# Altium project Gesturelink.PrjPcb (part 3 of 4)

## Sheet eMMC Memory.SchDoc
size A4; SheetNumber: 7; SheetTotal: 16
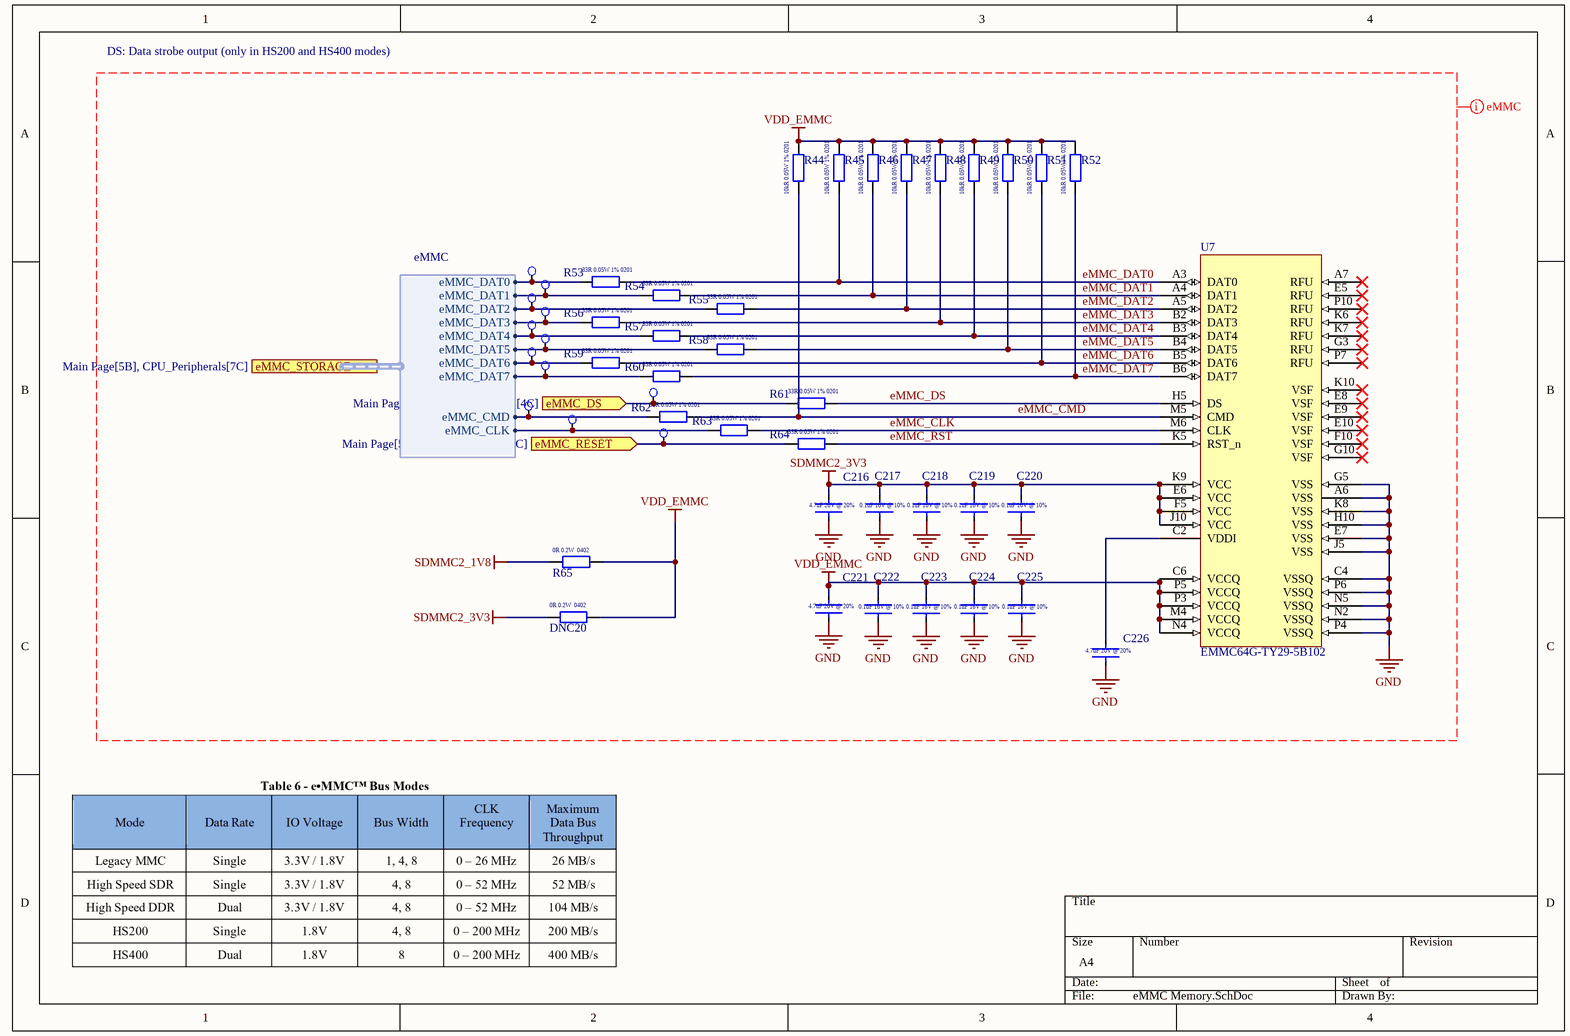
[diagram p14: eMMC Memory.SchDoc]

### Parts
C216  4.7uF  [CAPC1005X06L]  (value not drawn)
C217  0.1uF  [CAPC0603X03L]  (value not drawn)
C218  0.1uF  [CAPC0603X03L]  (value not drawn)
C219  0.1uF  [CAPC0603X03L]  (value not drawn)
C220  0.1uF  [CAPC0603X03L]  (value not drawn)
C221  4.7uF  [CAPC1005X06L]  (value not drawn)
C222  0.1uF  [CAPC0603X03L]  (value not drawn)
C223  0.1uF  [CAPC0603X03L]  (value not drawn)
C224  0.1uF  [CAPC0603X03L]  (value not drawn)
C225  0.1uF  [CAPC0603X03L]  (value not drawn)
C226  4.7uF  [CAPC1005X06L]  (value not drawn)
DNC20  CRCW04020000Z0EDHP  [RESC1005X04L]  (value not drawn)
R44  ERJ-1GNF1002C  [RESC0603X03L]  (value not drawn)
R45  ERJ-1GNF1002C  [RESC0603X03L]  (value not drawn)
R46  ERJ-1GNF1002C  [RESC0603X03L]  (value not drawn)
R47  ERJ-1GNF1002C  [RESC0603X03L]  (value not drawn)
R48  ERJ-1GNF1002C  [RESC0603X03L]  (value not drawn)
R49  ERJ-1GNF1002C  [RESC0603X03L]  (value not drawn)
R50  ERJ-1GNF1002C  [RESC0603X03L]  (value not drawn)
R51  ERJ-1GNF1002C  [RESC0603X03L]  (value not drawn)
R52  ERJ-1GNF1002C  [RESC0603X03L]  (value not drawn)
R53  ERJ-1GNF33R0C  [RESC0603X03L]  (value not drawn)
R54  ERJ-1GNF33R0C  [RESC0603X03L]  (value not drawn)
R55  ERJ-1GNF33R0C  [RESC0603X03L]  (value not drawn)
R56  ERJ-1GNF33R0C  [RESC0603X03L]  (value not drawn)
R57  ERJ-1GNF33R0C  [RESC0603X03L]  (value not drawn)
R58  ERJ-1GNF33R0C  [RESC0603X03L]  (value not drawn)
R59  ERJ-1GNF33R0C  [RESC0603X03L]  (value not drawn)
R60  ERJ-1GNF33R0C  [RESC0603X03L]  (value not drawn)
R61  ERJ-1GNF33R0C  [RESC0603X03L]  (value not drawn)
R62  ERJ-1GNF33R0C  [RESC0603X03L]  (value not drawn)
R63  ERJ-1GNF33R0C  [RESC0603X03L]  (value not drawn)
R64  ERJ-1GNF33R0C  [RESC0603X03L]  (value not drawn)
R65  CRCW04020000Z0EDHP  [RESC1005X04L]  (value not drawn)
TP7  Test Point  [Test Point]  (value not drawn)
TP8  Test Point  [Test Point]  (value not drawn)
TP9  Test Point  [Test Point]  (value not drawn)
TP10  Test Point  [Test Point]  (value not drawn)
TP11  Test Point  [Test Point]  (value not drawn)
TP12  Test Point  [Test Point]  (value not drawn)
TP13  Test Point  [Test Point]  (value not drawn)
TP14  Test Point  [Test Point]  (value not drawn)
TP15  Test Point  [Test Point]  (value not drawn)
TP16  Test Point  [Test Point]  (value not drawn)
TP17  Test Point  [Test Point]  (value not drawn)
TP18  Test Point  [Test Point]  (value not drawn)
U7  EMMC64G-TY29-5B102  [EMMC64G-TY29-5B102]

### Ports
eMMC_DS (in, see Main Page[5B], CPU_Peripherals[4C]), eMMC_RESET (in, see Main Page[5B], CPU_Peripherals[4C]), eMMC_STORAGE (harness eMMC, see Main Page[5B], CPU_Peripherals[7C])

### Harnesses
eMMC: eMMC_DAT0, eMMC_DAT1, eMMC_DAT2, eMMC_DAT3, eMMC_DAT4, eMMC_DAT5, eMMC_DAT6, eMMC_DAT7, eMMC_CMD, eMMC_CLK

### Nets
GND: C216.1 C217.1 C218.1 C219.1 C220.1 C221.1 C222.1 C223.1 C224.1 C225.1 C226.1 U7.A6(VSS) U7.C4(VSSQ) U7.E7(VSS) U7.G5(VSS) U7.H10(VSS) U7.J5(VSS) U7.K8(VSS) U7.N2(VSSQ) U7.N5(VSSQ) U7.P4(VSSQ) U7.P6(VSSQ)
SDMMC2_1V8: R65.1
SDMMC2_3V3: C216.2 C217.2 C218.2 C219.2 C220.2 DNC20.1 U7.E6(VCC) U7.F5(VCC) U7.J10(VCC) U7.K9(VCC)
VDD_EMMC: C221.2 C222.2 C223.2 C224.2 C225.2 DNC20.2 R44.2 R45.2 R46.2 R47.2 R48.2 R49.2 R50.2 R51.2 R52.2 R65.2 U7.C6(VCCQ) U7.M4(VCCQ) U7.N4(VCCQ) U7.P3(VCCQ) U7.P5(VCCQ)
eMMC_CLK: R63.2 U7.M6(CLK)
eMMC_CLK_MPU: R63.1 TP17.12 ; port eMMC_STORAGE.eMMC_CLK
eMMC_CMD: R44.1 R62.2 U7.M5(CMD)
eMMC_CMD_MPU: R62.1 TP16.12 ; port eMMC_STORAGE.eMMC_CMD
eMMC_DAT0: R45.1 R53.2 U7.A3(DAT0)
eMMC_DAT0_MPU: R53.1 TP7.12 ; port eMMC_STORAGE.eMMC_DAT0
eMMC_DAT1: R46.1 R54.2 U7.A4(DAT1)
eMMC_DAT1_MPU: R54.1 TP8.12 ; port eMMC_STORAGE.eMMC_DAT1
eMMC_DAT2: R47.1 R55.2 U7.A5(DAT2)
eMMC_DAT2_MPU: R55.1 TP9.12 ; port eMMC_STORAGE.eMMC_DAT2
eMMC_DAT3: R48.1 R56.2 U7.B2(DAT3)
eMMC_DAT3_MPU: R56.1 TP10.12 ; port eMMC_STORAGE.eMMC_DAT3
eMMC_DAT4: R49.1 R57.2 U7.B3(DAT4)
eMMC_DAT4_MPU: R57.1 TP11.12 ; port eMMC_STORAGE.eMMC_DAT4
eMMC_DAT5: R50.1 R58.2 U7.B4(DAT5)
eMMC_DAT5_MPU: R58.1 TP12.12 ; port eMMC_STORAGE.eMMC_DAT5
eMMC_DAT6: R51.1 R59.2 U7.B5(DAT6)
eMMC_DAT6_MPU: R59.1 TP13.12 ; port eMMC_STORAGE.eMMC_DAT6
eMMC_DAT7: R52.1 R60.2 U7.B6(DAT7)
eMMC_DAT7_MPU: R60.1 TP14.12 ; port eMMC_STORAGE.eMMC_DAT7
eMMC_DS: R61.2 U7.H5(DS)
eMMC_DS_MPU: R61.1 TP15.12 ; port eMMC_DS
eMMC_RST: R64.2 U7.K5(RST_n)
eMMC_RST_MPU: R64.1 TP18.12 ; port eMMC_RESET
NetC226_2: C226.2 U7.C2(VDDI)

Not connected (* = marked no-connect by the designer): U7 A7(RFU)* E5(RFU)* E8(VSF)* E9(VSF)* E10(VSF)* F10(VSF)* G3(RFU)* G10(VSF)* K6(RFU)* K7(RFU)* K10(VSF)* P7(RFU)* P10(RFU)*

### Layout directives
net class eMMC: eMMC_CLK, eMMC_CMD, eMMC_DAT0, eMMC_DAT1, eMMC_DAT2, eMMC_DAT3, eMMC_DAT4, eMMC_DAT5, eMMC_DAT6, eMMC_DAT7, eMMC_DS, eMMC_RST, GND, SDMMC2_1V8, SDMMC2_3V3, VDD_EMMC

### Notes on the sheet
- DS: Data strobe output (only in HS200 and HS400 modes)
- (in symbol CL05A475MO5NUNC) 4.7uF 20V @ 20%
- (in symbol CRCW04020000Z0EDHP) 0R 0.2W  0402
- (in symbol ERJ-1GNF33R0C) 33R 0.05W 1% 0201
- (in symbol ERJ-1GNF1002C) 10kR 0.05W 1% 0201
- (in symbol GRM033R61E104KE14J) 0.1uF 16V @ 10%

### Library data of the parts
C216 C221 C226 = CL05A475MO5NUNC: as C97 on sheet LPDDR4
C217-C220 C222-C225 = GRM033R61E104KE14J: as C98-C125 on sheet LPDDR4
DNC20 R65 = CRCW04020000Z0EDHP: 0 Ohms Jumper Chip Resistor 0402 (1005 Metric) Automotive AEC-Q200, Pulse Withstanding Thick Film; ComponentLink1Description: New link; ComponentLink1URL: https://www.digikey.com.au/en/products/detail/vishay-dale/CRCW04020000Z0EDHP/2222496
R44-R52 = ERJ-1GNF1002C: as R15 on sheet Power Management; ComponentLink1Description: New link; ComponentLink1URL: https://www.digikey.com.au/en/products/detail/panasonic-electronic-components/ERJ-1GNF1002C/2036226
R53-R64 = ERJ-1GNF33R0C: as R16-R20 on sheet Power Management; ComponentLink1Description: New link; ComponentLink1URL: https://www.digikey.com.au/en/products/detail/panasonic-electronic-components/ERJ-1GNF33R0C/2035941
U7 = EMMC64G-TY29-5B102: eMMC pSLC eMMC 5.1 (HS400) 153B 64GB; ComponentLink1Description: New link; ComponentLink1URL: https://www.digikey.com.au/en/products/detail/kingston-technology/EMMC64G-TY29-5B102/23544210?srsltid=AfmBOoplT4W8nAr74tqJNFMNLtQIICeKqThZaKy8fUOfiCqFJlsEGKlk

## Sheet WIFI and BLE.SchDoc
size 420 x 297 mm; SheetNumber: 8; SheetTotal: 16
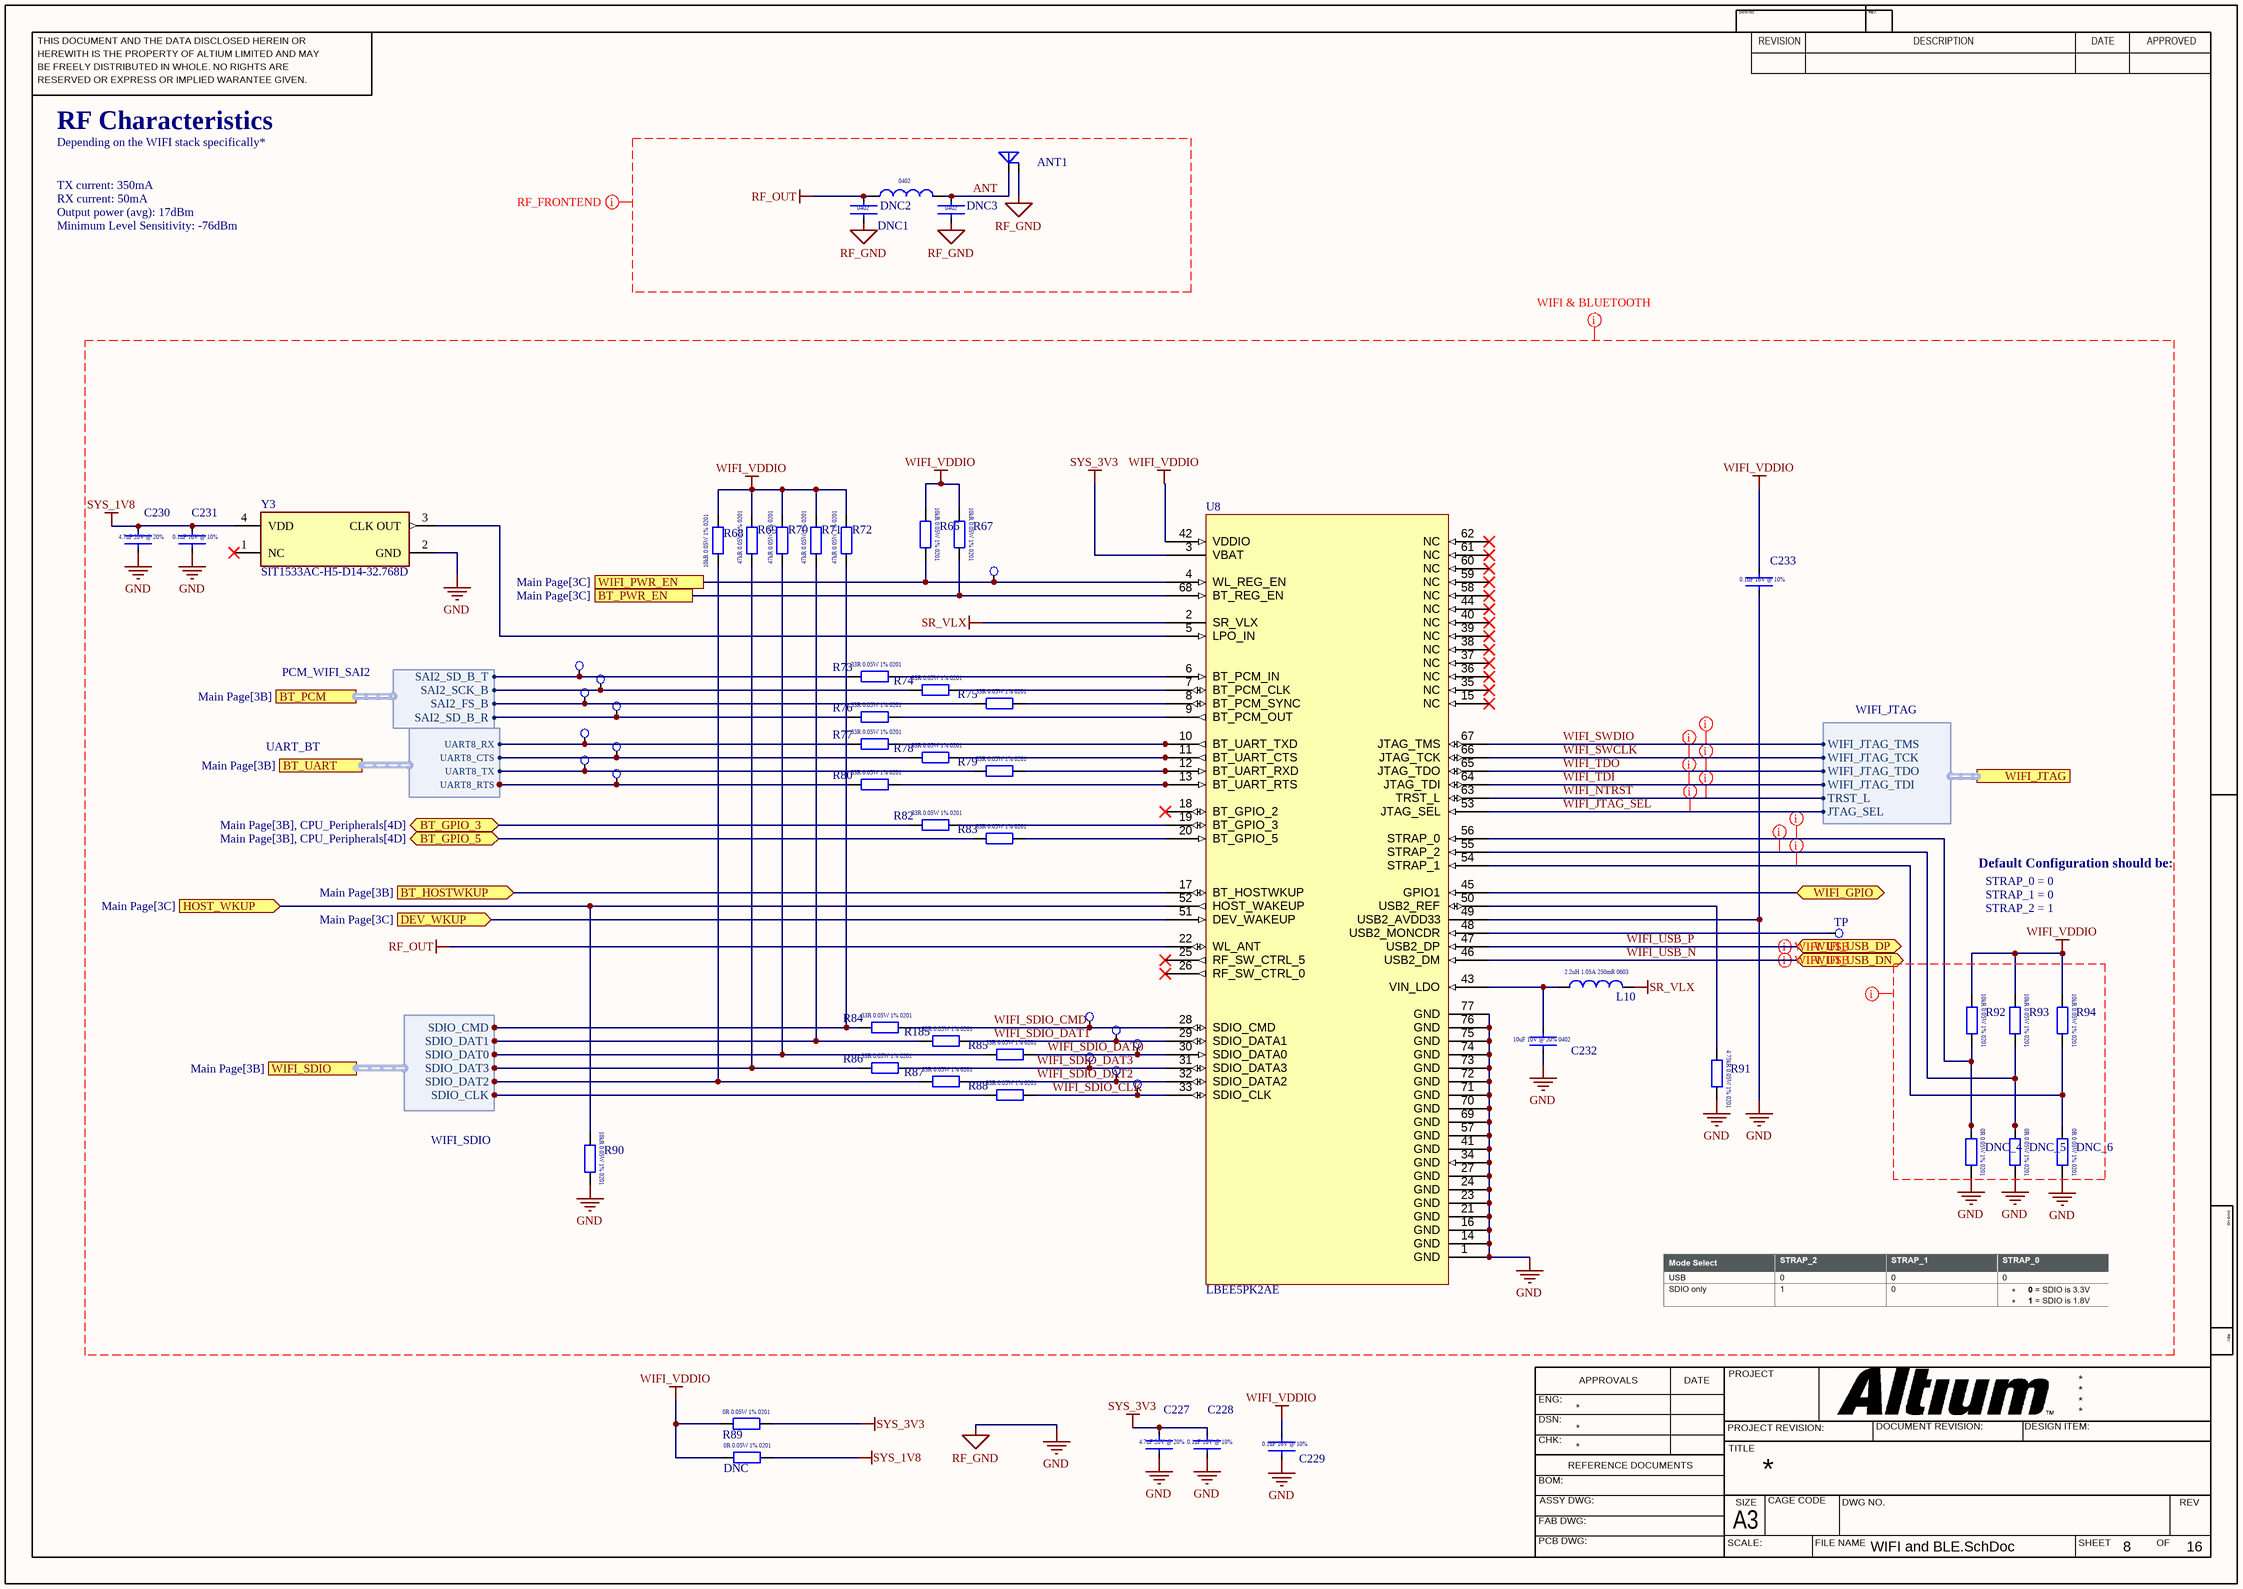
[diagram p15: WIFI and BLE.SchDoc]

### Parts
ANT1  ANT5320LL24R2455A  [ANT5320LL24R2455A]  (value not drawn)
C227  4.7uF  [CAPC1005X06L]  (value not drawn)
C228  0.1uF  [CAPC0603X03L]  (value not drawn)
C229  0.1uF  [CAPC0603X03L]  (value not drawn)
C230  4.7uF  [CAPC1005X06L]  (value not drawn)
C231  0.1uF  [CAPC0603X03L]  (value not drawn)
C232  GRT155R61A106ME13J  [CAPC1005X06L]  (value not drawn)
C233  0.1uF  [CAPC0603X03L]  (value not drawn)
DNC  ERJ-1GN0R00C  [RESC0603X03L]  (value not drawn)
DNC1  RF_GND_PI  [CAPC1005X06L]  (value not drawn)
DNC2  DNC RF Inductor  [RESC1005X04L]  (value not drawn)
DNC3  RF_GND_PI  [CAPC1005X06L]  (value not drawn)
DNC_4  ERJ-1GN0R00C  [RESC0603X03L]  (value not drawn)
DNC_5  ERJ-1GN0R00C  [RESC0603X03L]  (value not drawn)
DNC_6  ERJ-1GN0R00C  [RESC0603X03L]  (value not drawn)
L10  LQM18PN2R2MGHD  [INDC1608LPX08L]  (value not drawn)
R66  ERJ-1GNF1002C  [RESC0603X03L]  (value not drawn)
R67  ERJ-1GNF1002C  [RESC0603X03L]  (value not drawn)
R68  ERJ-1GNF1002C  [RESC0603X03L]  (value not drawn)
R69  AC0201FR-0747KL  [RESC0603X03L]  (value not drawn)
R70  AC0201FR-0747KL  [RESC0603X03L]  (value not drawn)
R71  AC0201FR-0747KL  [RESC0603X03L]  (value not drawn)
R72  AC0201FR-0747KL  [RESC0603X03L]  (value not drawn)
R73  ERJ-1GNF33R0C  [RESC0603X03L]  (value not drawn)
R74  ERJ-1GNF33R0C  [RESC0603X03L]  (value not drawn)
R75  ERJ-1GNF33R0C  [RESC0603X03L]  (value not drawn)
R76  ERJ-1GNF33R0C  [RESC0603X03L]  (value not drawn)
R77  ERJ-1GNF33R0C  [RESC0603X03L]  (value not drawn)
R78  ERJ-1GNF33R0C  [RESC0603X03L]  (value not drawn)
R79  ERJ-1GNF33R0C  [RESC0603X03L]  (value not drawn)
R80  ERJ-1GNF33R0C  [RESC0603X03L]  (value not drawn)
R82  ERJ-1GNF33R0C  [RESC0603X03L]  (value not drawn)
R83  ERJ-1GNF33R0C  [RESC0603X03L]  (value not drawn)
R84  ERJ-1GNF33R0C  [RESC0603X03L]  (value not drawn)
R85  ERJ-1GNF33R0C  [RESC0603X03L]  (value not drawn)
R86  ERJ-1GNF33R0C  [RESC0603X03L]  (value not drawn)
R87  ERJ-1GNF33R0C  [RESC0603X03L]  (value not drawn)
R88  ERJ-1GNF33R0C  [RESC0603X03L]  (value not drawn)
R89  ERJ-1GN0R00C  [RESC0603X03L]  (value not drawn)
R90  ERJ-1GNF1002C  [RESC0603X03L]  (value not drawn)
R91  AC0201FR-074K75L  [RESC0603X03L]  (value not drawn)
R92  ERJ-1GNF1002C  [RESC0603X03L]  (value not drawn)
R93  ERJ-1GNF1002C  [RESC0603X03L]  (value not drawn)
R94  ERJ-1GNF1002C  [RESC0603X03L]  (value not drawn)
R185  ERJ-1GNF33R0C  [RESC0603X03L]  (value not drawn)
TP  Test Point  [Test Point]  (value not drawn)
TP1  Test Point  [Test Point]  (value not drawn)
TP2  Test Point  [Test Point]  (value not drawn)
TP3  Test Point  [Test Point]  (value not drawn)
TP4  Test Point  [Test Point]  (value not drawn)
TP5  Test Point  [Test Point]  (value not drawn)
TP6  Test Point  [Test Point]  (value not drawn)
TP21  Test Point  [Test Point]  (value not drawn)
TP22  Test Point  [Test Point]  (value not drawn)
TP23  Test Point  [Test Point]  (value not drawn)
TP24  Test Point  [Test Point]  (value not drawn)
TP25  Test Point  [Test Point]  (value not drawn)
TP26  Test Point  [Test Point]  (value not drawn)
TP27  Test Point  [Test Point]  (value not drawn)
TP28  Test Point  [Test Point]  (value not drawn)
TP40  Test Point  [Test Point]  (value not drawn)
U8  LBEE5PK2AE  [LBEE5PK2AE]
Y3  SIT1533AC-H5-D14-32.768D  [FP-SiT1533-H-MFG]

### Ports
BT_GPIO_3 (bidir, see Main Page[3B], CPU_Peripherals[4D]), BT_GPIO_5 (bidir, see Main Page[3B], CPU_Peripherals[4D]), BT_HOSTWKUP (in, see Main Page[3B]), BT_PCM (harness PCM_WIFI_SAI2, see Main Page[3B]), BT_PWR_EN (see Main Page[3C]), BT_UART (harness UART_BT, see Main Page[3B]), DEV_WKUP (in, see Main Page[3C]), HOST_WKUP (in, see Main Page[3C]), WIFI_GPIO (bidir, see Main Page[3B], CPU_Peripherals[4E]), WIFI_JTAG (harness WIFI_JTAG, see Main Page[2B], Connector A[1B]), WIFI_PWR_EN (see Main Page[3C]), WIFI_SDIO (harness WIFI_SDIO, see Main Page[3B]), WIFI_USB_DN (bidir, see Main Page[3C]), WIFI_USB_DP (bidir, see Main Page[3C])

### Harnesses
WIFI_JTAG: WIFI_JTAG_TMS, WIFI_JTAG_TCK, WIFI_JTAG_TDO, WIFI_JTAG_TDI, TRST_L, JTAG_SEL
PCM_WIFI_SAI2: SAI2_FS_B, SAI2_SCK_B, SAI2_SD_B_R, SAI2_SD_B_T
WIFI_SDIO: SDIO_CLK, SDIO_CMD, SDIO_DAT0, SDIO_DAT1, SDIO_DAT2, SDIO_DAT3
UART_BT: UART8_CTS, UART8_RTS, UART8_RX, UART8_TX

### Nets
GND: ANT1.3(GND) C227.1 C228.1 C229.1 C230.1 C231.1 C232.1 C233.1 DNC1.1 DNC3.1 DNC_4.2 DNC_5.2 DNC_6.2 R90.2 R91.2 U8.1(GND) U8.14(GND) U8.16(GND) U8.21(GND) U8.23(GND) U8.24(GND) U8.27(GND) U8.34(GND) U8.41(GND) U8.49(USB2_AVDD33) U8.57(GND) U8.69(GND) U8.70(GND) U8.71(GND) U8.72(GND) U8.73(GND) U8.74(GND) U8.75(GND) U8.76(GND) U8.77(GND) Y3.2(GND)  [also labelled RF_GND]
RF_OUT: DNC1.2 DNC2.1 U8.22(WL_ANT)
SAI2_FS_B: R75.1 TP23.12 ; port BT_PCM.SAI2_FS_B
SAI2_SCK_B: R74.1 TP22.12 ; port BT_PCM.SAI2_SCK_B
SAI2_SD_A_R: R76.1 TP24.12 ; port BT_PCM.SAI2_SD_B_R
SAI2_SD_B_T: R73.1 TP21.12 ; port BT_PCM.SAI2_SD_B_T
SR_VLX: L10.2 U8.2(SR_VLX)
SYS_1V8: C230.2 C231.2 DNC.2 Y3.4(VDD)
SYS_3V3: C227.2 C228.2 R89.2 U8.3(VBAT)
UART8_CTS: R78.1 TP26.12 ; port BT_UART.UART8_CTS
UART8_RTS: R80.1 TP28.12 ; port BT_UART.UART8_RTS
UART8_RX: R77.1 TP25.12 ; port BT_UART.UART8_RX
UART8_TX: R79.1 TP27.12 ; port BT_UART.UART8_TX
WIFI_VDDIO: C229.2 C233.2 DNC.1 R66.1 R67.1 R68.2 R69.2 R70.2 R71.2 R72.2 R89.1 R92.1 R93.1 R94.1 U8.42(VDDIO)
ANT: ANT1.1(FEED) DNC2.2 DNC3.2
BT_GPIO_3: R82.1 ; port BT_GPIO_3
WIFI_JTAG_SEL: U8.53(JTAG_SEL) ; port WIFI_JTAG.JTAG_SEL
WIFI_NTRST: U8.63(TRST_L) ; port WIFI_JTAG.TRST_L
WIFI_SDIO_CLK: R88.2 TP6.12 U8.33(SDIO_CLK)
WIFI_SDIO_CMD: R84.2 TP1.12 U8.28(SDIO_CMD)
WIFI_SDIO_DAT0: R85.2 TP3.12 U8.30(SDIO_DATA0)
WIFI_SDIO_DAT1: R185.2 TP2.12 U8.29(SDIO_DATA1)
WIFI_SDIO_DAT2: R87.2 TP5.12 U8.32(SDIO_DATA2)
WIFI_SDIO_DAT3: R86.2 TP4.12 U8.31(SDIO_DATA3)
WIFI_SDMMC3_CK: R88.1 ; port WIFI_SDIO.SDIO_CLK
WIFI_SDMMC3_CMD: R72.1 R84.1 ; port WIFI_SDIO.SDIO_CMD
WIFI_SDMMC3_DAT0: R70.1 R85.1 ; port WIFI_SDIO.SDIO_DAT0
WIFI_SDMMC3_DAT1: R71.1 R185.1 ; port WIFI_SDIO.SDIO_DAT1
WIFI_SDMMC3_DAT2: R68.1 R87.1 ; port WIFI_SDIO.SDIO_DAT2
WIFI_SDMMC3_DAT3: R69.1 R86.1 ; port WIFI_SDIO.SDIO_DAT3
WIFI_SWCLK: U8.66(JTAG_TCK) ; port WIFI_JTAG.WIFI_JTAG_TCK
WIFI_SWDIO: U8.67(JTAG_TMS) ; port WIFI_JTAG.WIFI_JTAG_TMS
WIFI_TDI: U8.64(JTAG_TDI) ; port WIFI_JTAG.WIFI_JTAG_TDI
WIFI_TDO: U8.65(JTAG_TDO) ; port WIFI_JTAG.WIFI_JTAG_TDO
WIFI_USB_N: U8.46(USB2_DM) ; port WIFI_USB_DN
WIFI_USB_P: U8.47(USB2_DP) ; port WIFI_USB_DP
NetC232_2: C232.2 L10.1 U8.43(VIN_LDO)
NetDNC_4_1: DNC_4.1 R92.2 U8.56(STRAP_0)
NetDNC_5_1: DNC_5.1 R93.2 U8.55(STRAP_2)
NetDNC_6_1: DNC_6.1 R94.2 U8.54(STRAP_1)
NetR66_2: R66.2 TP40.12 U8.4(WL_REG_EN) ; port WIFI_PWR_EN
NetR67_2: R67.2 U8.68(BT_REG_EN) ; port BT_PWR_EN
NetR73_2: R73.2 U8.6(BT_PCM_IN)
NetR74_2: R74.2 U8.7(BT_PCM_CLK)
NetR75_2: R75.2 U8.8(BT_PCM_SYNC)
NetR76_2: R76.2 U8.9(BT_PCM_OUT)
NetR77_2: R77.2 U8.10(BT_UART_TXD)
NetR78_2: R78.2 U8.11(BT_UART_CTS)
NetR79_2: R79.2 U8.12(BT_UART_RXD)
NetR80_2: R80.2 U8.13(BT_UART_RTS)
NetR82_2: R82.2 U8.19(BT_GPIO_3)
NetR83_1: R83.1 ; port BT_GPIO_5
NetR83_2: R83.2 U8.20(BT_GPIO_5)
NetR90_1: R90.1 U8.52(HOST_WAKEUP) ; port HOST_WKUP
NetR91_1: R91.1 U8.50(USB2_REF)
NetTP_12: TP.12 U8.48(USB2_MONCDR)
NetU1_L7: U8.45(GPIO1) ; port WIFI_GPIO
NetU1_P2: U8.17(BT_HOSTWKUP) ; port BT_HOSTWKUP
NetU1_R2: U8.51(DEV_WAKEUP) ; port DEV_WKUP
NetU8_5: U8.5(LPO_IN) Y3.3(CLK_OUT)

Not connected (* = marked no-connect by the designer): U8 15(NC)* 18(BT_GPIO_2)* 25(RF_SW_CTRL_5)* 26(RF_SW_CTRL_0)* 35(NC)* 36(NC)* 37(NC)* 38(NC)* 39(NC)* 40(NC)* 44(NC)* 58(NC)* 59(NC)* 60(NC)* 61(NC)* 62(NC)*; Y3 1(NC)*

### Layout directives
net class RF Frontend: ANT, RF_GND, RF_OUT
net class Wifi Strapping Resistors: GND, RF_OUT, SR_VLX, SYS_1V8, SYS_3V3, WIFI_JTAG_SEL, WIFI_NTRST, WIFI_SDIO_CLK, WIFI_SDIO_CMD, WIFI_SDIO_DAT0, WIFI_SDIO_DAT1, WIFI_SDIO_DAT2, WIFI_SDIO_DAT3, WIFI_SWCLK, WIFI_SWDIO, WIFI_TDI, WIFI_TDO, WIFI_USB_N, WIFI_USB_P, WIFI_VDDIO
differential pair: WIFI_USB_N, WIFI_USB_P
net class WiFi & BlueTooth: GND, RF_OUT, SR_VLX, SYS_1V8, SYS_3V3, WIFI_JTAG_SEL, WIFI_NTRST, WIFI_SDIO_CLK, WIFI_SDIO_CMD, WIFI_SDIO_DAT0, WIFI_SDIO_DAT1, WIFI_SDIO_DAT2, WIFI_SDIO_DAT3, WIFI_SWCLK, WIFI_SWDIO, WIFI_TDI, WIFI_TDO, WIFI_USB_N, WIFI_USB_P, WIFI_VDDIO
net class WIFI STRAP GPIO: NetDNC_4_1, NetDNC_5_1, NetDNC_6_1
net class WIFI_JTAG; net class *: WIFI_NTRST, WIFI_SWCLK, WIFI_SWDIO, WIFI_TDI, WIFI_TDO
net class WIFI_JTAG: WIFI_JTAG_SEL

### Notes on the sheet
- RF Characteristics
- TX current: 350mA
- Depending on the WIFI stack specifically*
- RX current: 50mA
- Output power (avg): 17dBm
- Minimum Level Sensitivity: -76dBm
- Default Configuration should be:
- STRAP_0 = 0
- STRAP_1 = 0
- STRAP_2 = 1
- THIS DOCUMENT AND THE DATA DISCLOSED HEREIN OR
- HEREWITH IS THE PROPERTY OF ALTIUM LIMITED AND MAY
- DWG NO:
- REVISION
- REV:
- DESCRIPTION
- DATE
- APPROVED
- BE FREELY DISTRIBUTED IN WHOLE. NO RIGHTS ARE
- RESERVED OR EXPRESS OR IMPLIED WARANTEE GIVEN.
- ENG:
- APPROVALS
- PROJECT
- DSN:
- CHK:
- REFERENCE DOCUMENTS
- PROJECT REVISION:
- TITLE
- DOCUMENT REVISION:
- DESIGN ITEM:
- BOM:
- FAB DWG:
- PCB DWG:
- ASSY DWG:
- SCALE:
- A3
- SIZE
- CAGE CODE
- FILE NAME
- DWG NO.
- SHEET
- OF
- REV
- (in symbol AC0201FR-074K75L) 4.75kR 0.05W 1% 0201
- (in symbol AC0201FR-0747KL) 47kR 0.05W 1% 0201
- (in symbol CL05A475MO5NUNC) 4.7uF 20V @ 20%
- (in symbol DNC RF Inductor) 0402
- (in symbol ERJ-1GN0R00C) 0R 0.05W 1% 0201
- (in symbol ERJ-1GNF33R0C) 33R 0.05W 1% 0201
- (in symbol ERJ-1GNF1002C) 10kR 0.05W 1% 0201
- (in symbol GRM033R61E104KE14J) 0.1uF 16V @ 10%
- (in symbol GRT155R61A106ME13J) 10uF 10V @ 20% 0402
- (in symbol LQM18PN2R2MGHD) 2.2uH 1.05A 250mR 0603
- (in symbol RF_GND_PI) 0402

### Library data of the parts
ANT1 = ANT5320LL24R2455A: RF ANTENNA WLAN Chip Solder Surface Mount
C227 C230 = CL05A475MO5NUNC: 4.7 µF ±20% 16V Ceramic Capacitor X5R 0402 (1005 Metric)
C228 C229 C231 C233 = GRM033R61E104KE14J: 0.1 µF ±10% 25V Ceramic Capacitor X5R 0201 (0603 Metric)0.1 µF ±10% 25V Ceramic Capacitor X5R 0201 (0603 Metric)
C232 = GRT155R61A106ME13J: 10 µF ±20% 10V Ceramic Capacitor X5R 0402 (1005 Metric); ComponentLink1Description: New link; ComponentLink1URL: https://www.digikey.com.au/en/products/detail/murata-electronics/GRT155R61A106ME13J/19115510
DNC DNC_4-DNC_6 R89 = ERJ-1GN0R00C: 0 Ohms Jumper Chip Resistor 0201 (0603 Metric) Thick Film; ComponentLink1Description: New link; ComponentLink1URL: https://www.digikey.com.au/en/products/detail/panasonic-electronic-components/ERJ-1GN0R00C/3982613
DNC1 DNC3 = RF_GND_PI: Pi filter chip antenna, Do not connect!
DNC2 = DNC RF Inductor: Inductor for PI filter, DNC
L10 = LQM18PN2R2MGHD: 2.2 µH Shielded Multilayer Inductor 1.05 A 250mOhm Max 0603 (1608 Metric); ComponentLink1Description: New link; ComponentLink1URL: https://www.digikey.com.au/en/products/detail/murata-electronics/LQM18PN2R2MGHD/6606107
R66-R68 R90 R92-R94 = ERJ-1GNF1002C: 10 kOhms ±1% 0.05W, 1/20W Chip Resistor 0201 (0603 Metric) Thick Film; ComponentLink1Description: New link; ComponentLink1URL: https://www.digikey.com.au/en/products/detail/panasonic-electronic-components/ERJ-1GNF1002C/2036226
R69-R72 = AC0201FR-0747KL: 47 kOhms ±1% 0.05W, 1/20W Chip Resistor 0201 (0603 Metric) Automotive AEC-Q200, Moisture Resistant Thick Film; ComponentLink1Description: New link; ComponentLink1URL: https://www.digikey.com.au/en/products/detail/yageo/AC0201FR-0747KL/5894664
R73-R80 R82-R88 R185 = ERJ-1GNF33R0C: 33 Ohms ±1% 0.05W, 1/20W Chip Resistor 0201 (0603 Metric) Thick Film; ComponentLink1Description: New link; ComponentLink1URL: https://www.digikey.com.au/en/products/detail/panasonic-electronic-components/ERJ-1GNF33R0C/2035941
R91 = AC0201FR-074K75L: 4.75 kOhms ±1% 0.05W, 1/20W Chip Resistor 0201 (0603 Metric) Automotive AEC-Q200, Moisture Resistant Thick Film; ComponentLink1Description: New link; ComponentLink1URL: https://www.digikey.com.au/en/products/detail/yageo/AC0201FR-074K75L/5894685
U8 = LBEE5PK2AE: Bluetooth, WiFi 802.11a/b/g/n/ac, Bluetooth v5.2 Transceiver Module 2.412GHz ~ 2.472GHz, 5.18GHz ~ 5.825GHz Surface Mount
Y3 = CMP-25159-259659-1: MEMS OSC XO 32.7680KHZ LVCMOS; Frequency: 32.768kHz; Max Supply Current: 1.3uA; Frequency Stability: 75ppm; Mount: Surface Mount; Height: 0.024inch; Case/Package: SMD/SMT; Width: 0.047inch; Packaging: Cut Tape; Series: SiT1533; Max Operating Temperature: 70°C; RoHS Compliant: Yes; Length: 0.079inch; Min Operating Temperature: -10°C

## Sheet Display.SchDoc
size A4; SheetNumber: 14; SheetTotal: 16
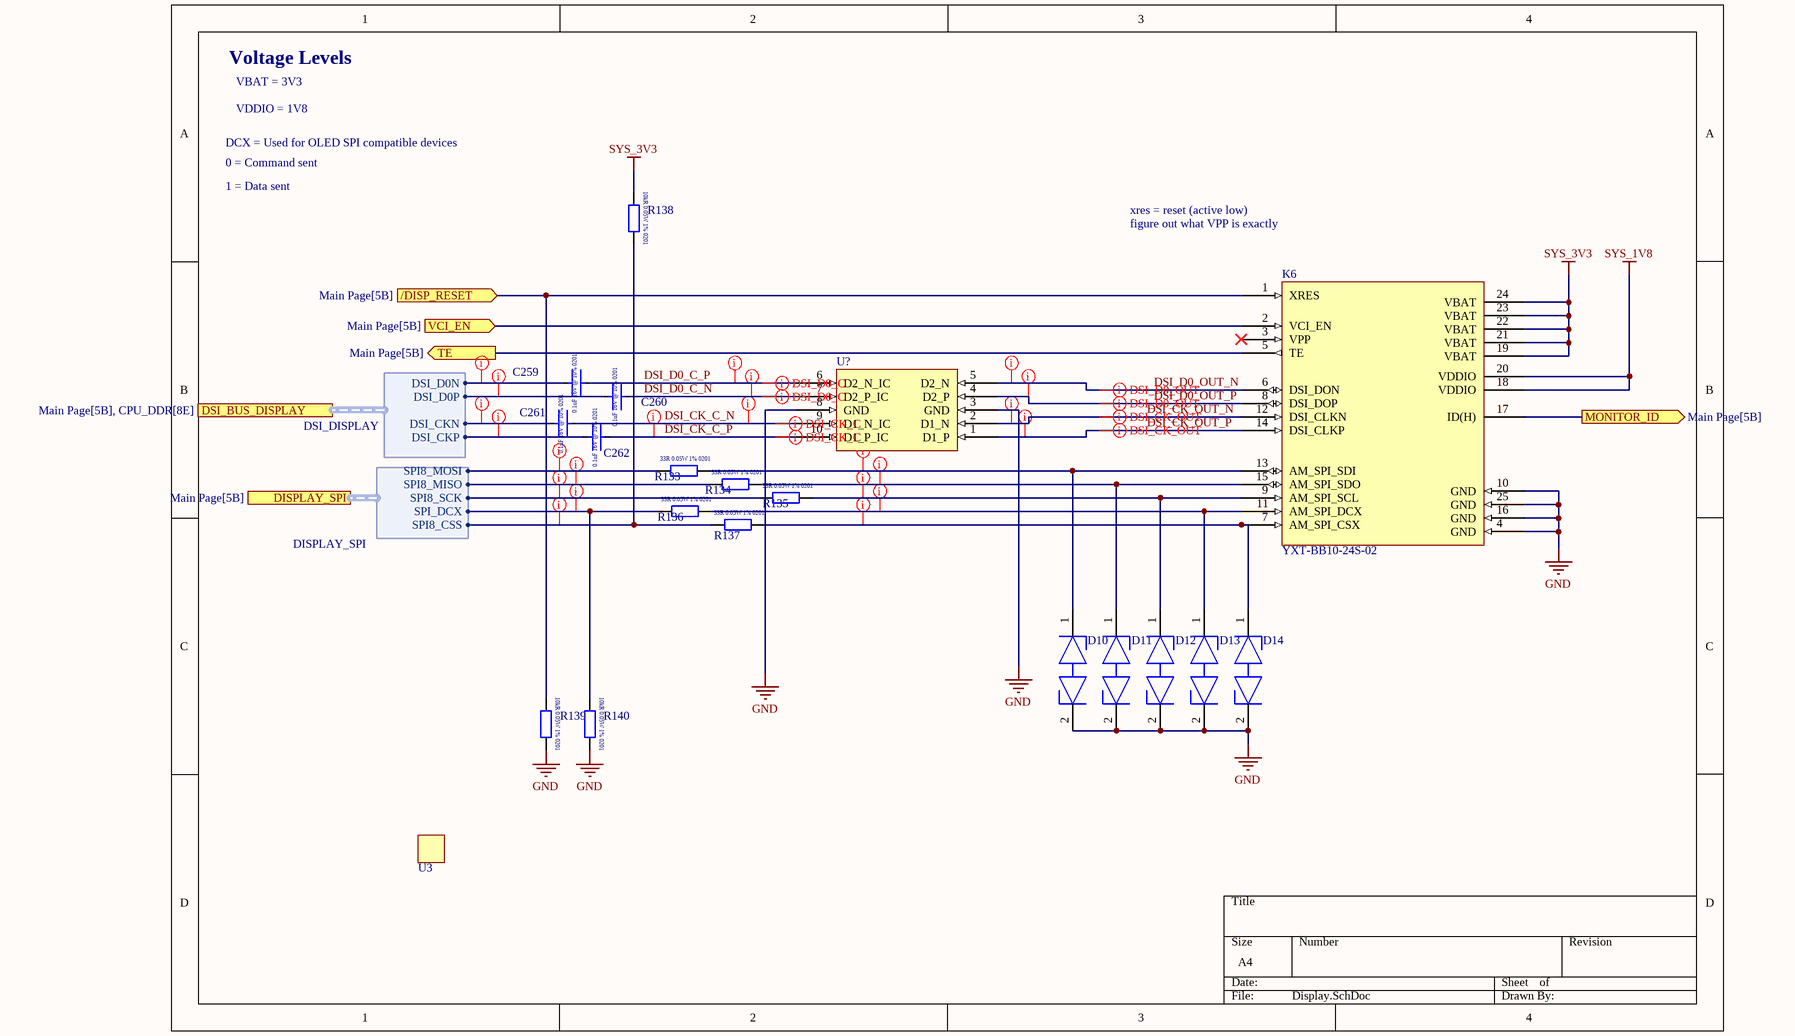
[diagram p16: Display.SchDoc]

### Parts
(Parts that share a designator on the sheet are numbered #1, #2 ... from top to bottom, then left to right.)
C259  0.1uF  [CAPC0603X03L]  (value not drawn)
C260  0.1uF  [CAPC0603X03L]  (value not drawn)
C261  0.1uF  [CAPC0603X03L]  (value not drawn)
C262  0.1uF  [CAPC0603X03L]  (value not drawn)
D10  PESD5V0H1BSFYL  [FP-SOD962-2-MFG]  (value not drawn)
D11  PESD5V0H1BSFYL  [FP-SOD962-2-MFG]  (value not drawn)
D12  PESD5V0H1BSFYL  [FP-SOD962-2-MFG]  (value not drawn)
D13  PESD5V0H1BSFYL  [FP-SOD962-2-MFG]  (value not drawn)
D14  PESD5V0H1BSFYL  [FP-SOD962-2-MFG]  (value not drawn)
K6  YXT-BB10-24S-02  [YXT_BB10_24S_02]
R133  ERJ-1GNF33R0C  [RESC0603X03L]  (value not drawn)
R134  ERJ-1GNF33R0C  [RESC0603X03L]  (value not drawn)
R135  ERJ-1GNF33R0C  [RESC0603X03L]  (value not drawn)
R136  ERJ-1GNF33R0C  [RESC0603X03L]  (value not drawn)
R137  ERJ-1GNF33R0C  [RESC0603X03L]  (value not drawn)
R138  ERJ-1GNF1002C  [RESC0603X03L]  (value not drawn)
R139  ERJ-1GNF1002C  [RESC0603X03L]  (value not drawn)
R140  ERJ-1GNF1002C  [RESC0603X03L]  (value not drawn)
U3#2  UCM-iMX95  [UCM-iMX95]  (value not drawn)
U?#7  ECMF4-40A100N10  [ECMF4-40A100N10]  (value not drawn)

### Ports
/DISP_RESET (in, see Main Page[5B]), DISPLAY_SPI (harness DISPLAY_SPI, see Main Page[5B]), DSI_BUS_DISPLAY (harness DSI_DISPLAY, see Main Page[5B], CPU_DDR[8E]), MONITOR_ID (out, see Main Page[5B]), TE (out, see Main Page[5B]), VCI_EN (in, see Main Page[5B])

### Harnesses
DSI_DISPLAY: DSI_CKN, DSI_CKP, DSI_D0N, DSI_D0P
DISPLAY_SPI: SPI8_CSS, SPI8_MISO, SPI8_MOSI, SPI8_SCK, SPI_DCX

### Nets
GND: D10.2(K2) D11.2(K2) D12.2(K2) D13.2(K2) D14.2(K2) K6.4(GND) K6.10(GND) K6.16(GND) K6.25(GND) R139.2 R140.2 U?#7.3(GND) U?#7.8(GND)
SYS_1V8: K6.18(VDDIO) K6.20(VDDIO)
SYS_3V3: K6.19(VBAT) K6.21(VBAT) K6.22(VBAT) K6.23(VBAT) K6.24(VBAT) R138.1
DISPLAY_RESET: K6.1(XRES) R139.1 ; port /DISP_RESET
DSI_CK_C_N: C261.1 U?#7.9(D1_N_IC)
DSI_CK_C_P: C262.1 U?#7.10(D1_P_IC)
DSI_CK_OUT_N: K6.12(DSI_CLKN) U?#7.2(D1_N)
DSI_CK_OUT_P: K6.14(DSI_CLKP) U?#7.1(D1_P)
DSI_CLK_N: C261.2 ; port DSI_BUS_DISPLAY.DSI_CKN
DSI_CLK_P: C262.2 ; port DSI_BUS_DISPLAY.DSI_CKP
DSI_D0_C_N: C260.1 U?#7.7(D2_P_IC)
DSI_D0_C_P: C259.1 U?#7.6(D2_N_IC)
DSI_D0_OUT_N: K6.6(DSI_DON) U?#7.5(D2_N)
DSI_D0_OUT_P: K6.8(DSI_DOP) U?#7.4(D2_P)
DSI_DATA_D0_N: C260.2 ; port DSI_BUS_DISPLAY.DSI_D0P
DSI_DATA_D0_P: C259.2 ; port DSI_BUS_DISPLAY.DSI_D0N
SPI8_CSS: R137.1 R138.2 ; port DISPLAY_SPI.SPI8_CSS
SPI8_DCX: R136.1 R140.1 ; port DISPLAY_SPI.SPI_DCX
SPI8_MISO: R134.1 ; port DISPLAY_SPI.SPI8_MISO
SPI8_MOSI: R133.1 ; port DISPLAY_SPI.SPI8_MOSI
SPI8_SCK: R135.1 ; port DISPLAY_SPI.SPI8_SCK
NetD10_1: D10.1(K1) K6.13(AM_SPI_SDI) R133.2
NetD11_1: D11.1(K1) K6.15(AM_SPI_SDO) R134.2
NetD12_1: D12.1(K1) K6.9(AM_SPI_SCL) R135.2
NetD13_1: D13.1(K1) K6.11(AM_SPI_DCX) R136.2
NetD14_1: D14.1(K1) K6.7(AM_SPI_CSX) R137.2
NetK6_2: K6.2(VCI_EN) ; port VCI_EN
NetK6_5: K6.5(TE) ; port TE
NetK6_17: K6.17(ID(H)) ; port MONITOR_ID

Not connected (* = marked no-connect by the designer): K6 3(VPP)*

### Layout directives
net class DISPLAY_SPI: NetD10_1, NetD11_1, NetD12_1, NetD13_1, NetD14_1, SPI8_CSS, SPI8_DCX, SPI8_MISO, SPI8_MOSI, SPI8_SCK
net class MIPI DSI to display: DSI_CK_C_N, DSI_CK_C_P, DSI_CK_OUT_N, DSI_CK_OUT_P, DSI_CLK_N, DSI_CLK_P, DSI_D0_C_N, DSI_D0_C_P, DSI_D0_OUT_N, DSI_D0_OUT_P, DSI_DATA_D0_N, DSI_DATA_D0_P
differential pair: DSI_CK_C_N, DSI_CK_C_P, DSI_CK_OUT_N, DSI_CK_OUT_P, DSI_D0_C_N, DSI_D0_C_P, DSI_D0_OUT_N, DSI_D0_OUT_P

### Notes on the sheet
- Voltage Levels
- VBAT = 3V3
- VDDIO = 1V8
- DCX = Used for OLED SPI compatible devices
- 0 = Command sent
- 1 = Data sent
- xres = reset (active low)
- figure out what VPP is exactly
- (in symbol ERJ-1GNF33R0C) 33R 0.05W 1% 0201
- (in symbol ERJ-1GNF1002C) 10kR 0.05W 1% 0201
- (in symbol GRM033R61E104KE14J) 0.1uF 16V @ 10% 0201

### Library data of the parts
C259-C262 = GRM033R61E104KE14J: as C228 on sheet WIFI and BLE; ComponentLink1Description: New link; ComponentLink1URL: https://www.digikey.com.au/en/products/detail/murata-electronics/GRM033R61E104KE14J/4904732?s=N4IgTCBcDaIOICUCyAGAzGhA2AjAURxQBYBpAogKRAF0BfIA
D10-D14 = CMP-14436-000004-1: TVS DIODE 5V 5V DSN0603-2; Manufacturer: Nexperia; Breakdown Voltage: 6V; Direction: Bidirectional; Value: 0.15pF; Clamping Voltage: 6.3V; Number Of Channels: 1; Peak Pulse Current: 7A; Max Junction Temp: +150°C; Lead Free: Yes; Reverse Standoff Voltage: 5V; Footprint Url: https://assets.nexperia.com/documents/outline-drawing/SOD962-2.pdf; ComponentLink2Description: Datasheet; Height: 0.32mm; Ambient Temperature Range Low: -40°C; Manufacturer Part Number: PESD5V0H1BSFYL; Octopart: https://octopart.com/pesd5v0h1bsfyl-nexperia-78741149; Ambient Temperature Range High: +125°C; RoHS: TRUE; Temperature: to +150°C; Capacitance: 0.15pF; ComponentLink2URL: https://assets.nexperia.com/documents/data-sheet/PESD5V0H1BSF.pdf; Temperature Range High: +150°C; Device Class L2: TVS Diodes; Digikey Description: TVS DIODE 5V 5V DSN0603-2; Category: Diode; Device Class L3: unset; Device Class L1: Circuit Protection; Package: SOD962-2; Automotive: No
K6 = YXT-BB10-24S-02: P=0.4mm Wire To Board / Wire To Wire Connector RoHS -> 24 pin
R133-R137 = ERJ-1GNF33R0C: as R73-R80 on sheet WIFI and BLE; ComponentLink1Description: New link; ComponentLink1URL: https://www.digikey.com.au/en/products/detail/panasonic-electronic-components/ERJ-1GNF33R0C/2035941
R138-R140 = ERJ-1GNF1002C: as R66-R68 on sheet WIFI and BLE; ComponentLink1Description: New link; ComponentLink1URL: https://www.digikey.com.au/en/products/detail/panasonic-electronic-components/ERJ-1GNF1002C/2036226
U3#2 = UCM-iMX95: ARM Cortex-A55 6x CPU cores, 2.0GHz / Up to 16GB LPDDR5 and 128GB eMMC / ARM Mali GPU, 4K VPU and AI/ML NPU / Real-time ARM Cortex-M7 MCU / Tiny size and weight - 28 x 40 mm, 10 gram
U?#7 = ECMF4-40A100N10: 4 Line Common Mode Choke Surface Mount 100mA DCR 3Ohm (Typ); ComponentLink1Description: New link; ComponentLink1URL: https://www.digikey.com/en/products/detail/stmicroelectronics/ECMF4-40A100N10/16379603

## Sheet Connector B.SchDoc
size A4; SheetNumber: 13; SheetTotal: 16
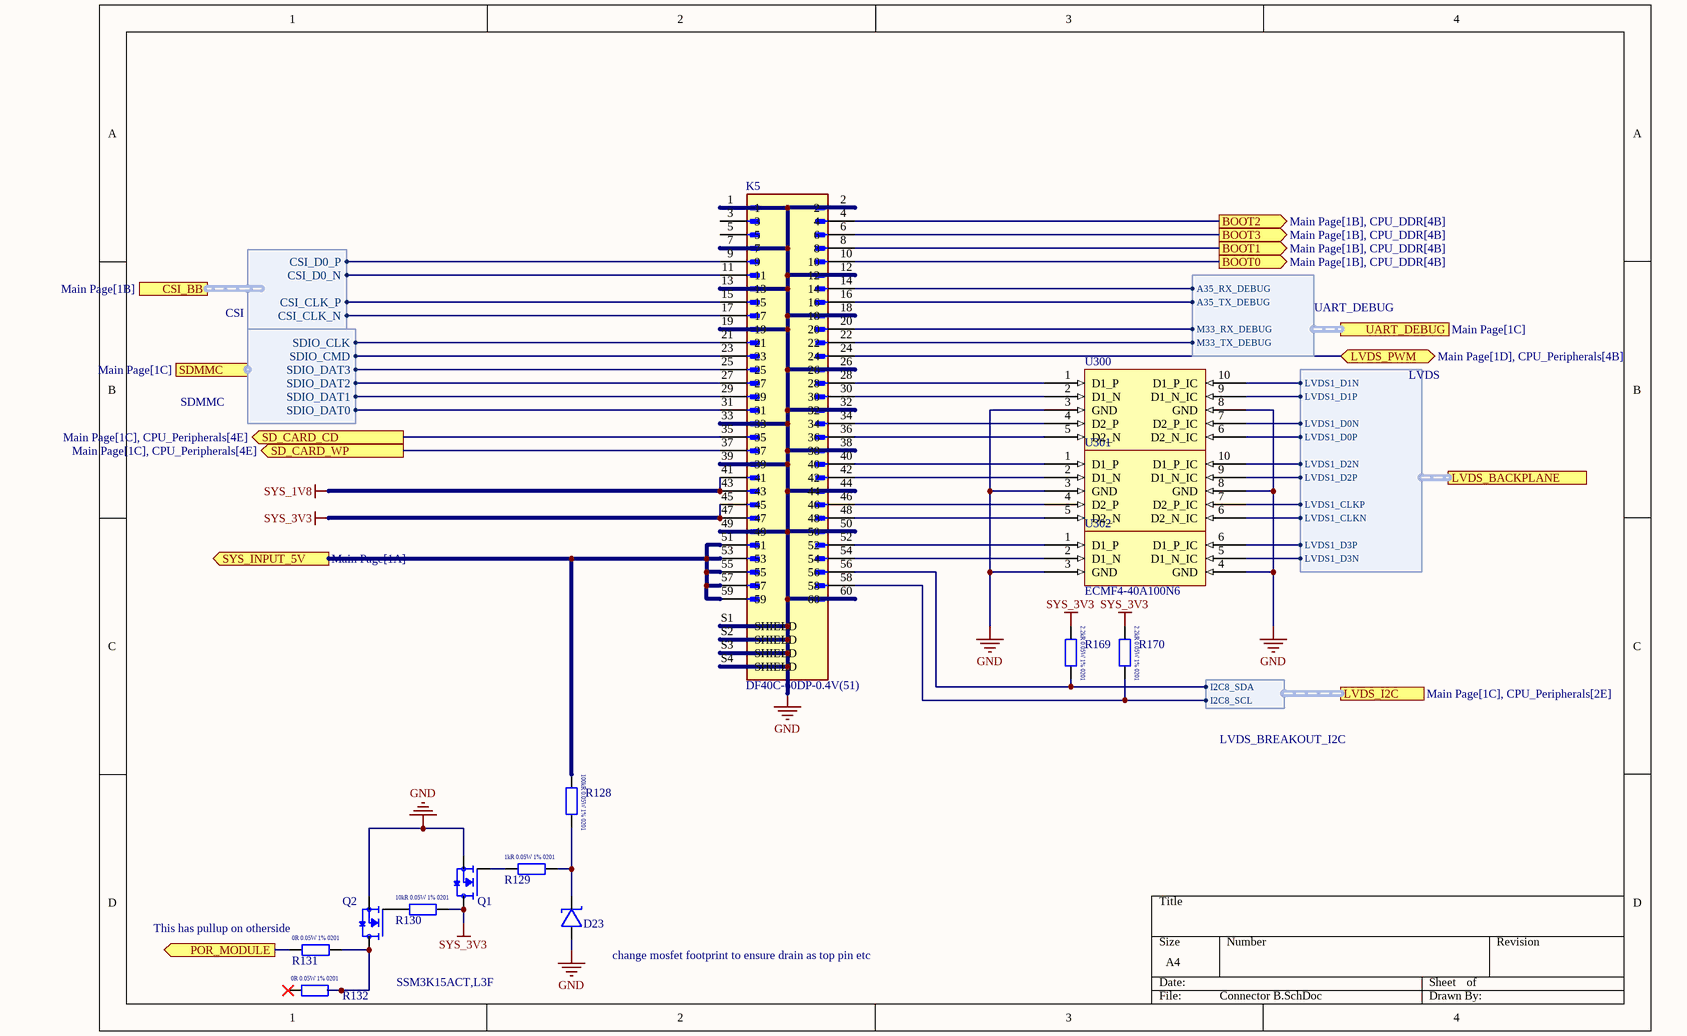
[diagram p17: Connector B.SchDoc]

### Parts
D23  RCLAMP04041PW.C  [RCLAMP04041PW.C]  (value not drawn)
K5  DF40C-60DP-0.4V(51)  [HIROSE_DF40C-60DP-0.4V(51)]
Q1  SSM3K15ACT,L3F  [SSM3K15ACT]
Q2  SSM3K15ACT,L3F  [SSM3K15ACT]  (value not drawn)
R128  ERJ-1GNF1003C  [RESC0603X03L]  (value not drawn)
R129  ERJ-1GNF1001C  [RESC0603X03L]  (value not drawn)
R130  ERJ-1GNF1002C  [RESC0603X03L]  (value not drawn)
R131  ERJ-1GN0R00C  [RESC0603X03L]  (value not drawn)
R132  ERJ-1GN0R00C  [RESC0603X03L]  (value not drawn)
R169  RC0201FR-072K2L  [RESC0603X03L]  (value not drawn)
R170  RC0201FR-072K2L  [RESC0603X03L]  (value not drawn)
U300  ECMF4-40A100N10  [ECMF4-40A100N10]
U301  ECMF4-40A100N10  [ECMF4-40A100N10]
U302  ECMF4-40A100N6  [ECMF2-40A100N6]

### Ports
BOOT0 (out, see Main Page[1B], CPU_DDR[4B]), BOOT1 (out, see Main Page[1B], CPU_DDR[4B]), BOOT2 (out, see Main Page[1B], CPU_DDR[4B]), BOOT3 (out, see Main Page[1B], CPU_DDR[4B]), CSI_BB (harness CSI, see Main Page[1B]), LVDS_BACKPLANE (harness LVDS, see Main Page[1A]), LVDS_I2C (harness LVDS_BREAKOUT_I2C, see Main Page[1C], CPU_Peripherals[2E]), LVDS_PWM (bidir, see Main Page[1D], CPU_Peripherals[4B]), POR_MODULE (out, see Main Page[1A], CPU_DDR[4B], Power Management[3F]), SD_CARD_CD (out, see Main Page[1C], CPU_Peripherals[4E]), SD_CARD_WP (out, see Main Page[1C], CPU_Peripherals[4E]), SDMMC (harness SDMMC, see Main Page[1C]), SYS_INPUT_5V (out, see Main Page[1A]), UART_DEBUG (harness UART_DEBUG, see Main Page[1C])

### Harnesses
SDMMC: SDIO_CLK, SDIO_CMD, SDIO_DAT0, SDIO_DAT1, SDIO_DAT2, SDIO_DAT3
UART_DEBUG: A35_RX_DEBUG, A35_TX_DEBUG, M33_RX_DEBUG, M33_TX_DEBUG
LVDS: LVDS1_CLKN, LVDS1_CLKP, LVDS1_D0N, LVDS1_D0P, LVDS1_D1N, LVDS1_D1P, LVDS1_D2N, LVDS1_D2P, LVDS1_D3N, LVDS1_D3P
LVDS_BREAKOUT_I2C: I2C8_SCL, I2C8_SDA
CSI: CSI_CLK_N, CSI_CLK_P, CSI_D0_N, CSI_D0_P

### Nets
GND: D23.1 K5.1 K5.2 K5.7 K5.12 K5.13 K5.18 K5.19 K5.26 K5.32 K5.33 K5.38 K5.39 K5.44 K5.49 K5.50 K5.60 K5.S1(SHIELD) K5.S2(SHIELD) K5.S3(SHIELD) K5.S4(SHIELD) Q1.3(S) Q2.3(S) U300.3(GND) U300.8(GND) U301.3(GND) U301.8(GND) U302.3(GND) U302.4(GND)
I2C8_SCL: K5.58 R170.2 ; port LVDS_I2C.I2C8_SCL
I2C8_SDA: K5.56 R169.2 ; port LVDS_I2C.I2C8_SDA
SYS_1V8: K5.41 K5.43
SYS_3V3: K5.45 K5.47 Q1.2(D) R130.2 R169.1 R170.1
USART2_RX: K5.20 ; port UART_DEBUG.M33_RX_DEBUG
USART2_TX: K5.22 ; port UART_DEBUG.M33_TX_DEBUG
USART6_RX: K5.14 ; port UART_DEBUG.A35_RX_DEBUG
USART6_TX: K5.16 ; port UART_DEBUG.A35_TX_DEBUG
USB_VIN: K5.51 K5.53 K5.55 K5.57 K5.59 R128.1 ; port SYS_INPUT_5V
/NRST: R131.1 ; port POR_MODULE
BOOT0: K5.10 ; port BOOT0
BOOT1: K5.8 ; port BOOT1
BOOT2: K5.4 ; port BOOT2
BOOT3: K5.6 ; port BOOT3
CSI_CK_N: K5.17 ; port CSI_BB.CSI_CLK_N
CSI_CK_P: K5.15 ; port CSI_BB.CSI_CLK_P
CSI_D0_N: K5.11 ; port CSI_BB.CSI_D0_N
CSI_D0_P: K5.9 ; port CSI_BB.CSI_D0_P
LVDS1_CLK_N: U301.6(D2_N_IC) ; port LVDS_BACKPLANE.LVDS1_CLKN
LVDS1_CLK_P: U301.7(D2_P_IC) ; port LVDS_BACKPLANE.LVDS1_CLKP
LVDS1_D0_N: U300.7(D2_P_IC) ; port LVDS_BACKPLANE.LVDS1_D0N
LVDS1_D0_P: U300.6(D2_N_IC) ; port LVDS_BACKPLANE.LVDS1_D0P
LVDS1_D1_N: U300.10(D1_P_IC) ; port LVDS_BACKPLANE.LVDS1_D1N
LVDS1_D1_P: U300.9(D1_N_IC) ; port LVDS_BACKPLANE.LVDS1_D1P
LVDS1_D2_N: U301.10(D1_P_IC) ; port LVDS_BACKPLANE.LVDS1_D2N
LVDS1_D2_P: U301.9(D1_N_IC) ; port LVDS_BACKPLANE.LVDS1_D2P
LVDS1_D3_N: U302.5(D1_N_IC) ; port LVDS_BACKPLANE.LVDS1_D3N
LVDS1_D3_P: U302.6(D1_P_IC) ; port LVDS_BACKPLANE.LVDS1_D3P
SD_CARD_CD: K5.35 ; port SD_CARD_CD
SD_CARD_WP: K5.37 ; port SD_CARD_WP
SDMMC_CLK: K5.21 ; port SDMMC.SDIO_CLK
SDMMC_CMD: K5.23 ; port SDMMC.SDIO_CMD
SDMMC_DAT0: K5.31 ; port SDMMC.SDIO_DAT0
SDMMC_DAT1: K5.29 ; port SDMMC.SDIO_DAT1
SDMMC_DAT2: K5.27 ; port SDMMC.SDIO_DAT2
SDMMC_DAT3: K5.25 ; port SDMMC.SDIO_DAT3
TIM20_PWM: K5.24 ; port LVDS_PWM
NetD23_2: D23.2 R128.2 R129.2
NetK5_28: K5.28 U300.1(D1_P)
NetK5_30: K5.30 U300.2(D1_N)
NetK5_34: K5.34 U300.4(D2_P)
NetK5_36: K5.36 U300.5(D2_N)
NetK5_40: K5.40 U301.1(D1_P)
NetK5_42: K5.42 U301.2(D1_N)
NetK5_46: K5.46 U301.4(D2_P)
NetK5_48: K5.48 U301.5(D2_N)
NetK5_52: K5.52 U302.1(D1_P)
NetK5_54: K5.54 U302.2(D1_N)
NetQ1_1: Q1.1(G) R129.1
NetQ2_1: Q2.1(G) R130.1
NetQ2_2: Q2.2(D) R131.2 R132.2

Not connected (* = marked no-connect by the designer): K5 3 5; R132 1*

### Notes on the sheet
- (near R131) This has pullup on otherside
- (near D23) change mosfet footprint to ensure drain as top pin etc
- (in symbol ERJ-1GN0R00C) 0R 0.05W 1% 0201
- (in symbol ERJ-1GNF1001C) 1kR 0.05W 1% 0201
- (in symbol ERJ-1GNF1002C) 10kR 0.05W 1% 0201
- (in symbol ERJ-1GNF1003C) 100kR 0.05W 1% 0201
- (in symbol RC0201FR-072K2L) 2.2kR 0.05W 1% 0201

### Library data of the parts
D23 = RCLAMP04041PW.C: 8V Clamp 20A (8/20µs) Ipp Tvs Diode Surface Mount 2-DFN (1x0.6); ComponentLink1Description: New link; ComponentLink1URL: https://www.digikey.com.au/en/products/detail/semtech-corporation/RCLAMP04041PW-C/21379403
K5 = DF40C-60DP-0.4V(51): 60 Position Connector Plug, Outer Shroud Contacts Surface Mount Gold; MF: Hirose Electric; Value: *; Purchase-URL: https://pricing.snapeda.com/search/part/DF40C-60DP-0.4V(51)/?ref=eda; MP: DF40C-60DP-0.4V(51); Price: None; Package: None; Availability: In Stock; SnapEDA_Link: https://www.snapeda.com/parts/DF40C-60DP-0.4V(51)/Hirose+Electric+Co+Ltd/view-part/?ref=snap; Check_prices: https://www.snapeda.com/parts/DF40C-60DP-0.4V(51)/Hirose+Electric+Co+Ltd/view-part/?ref=eda
Q1 Q2 = SSM3K15ACT,L3F: N-Channel 30 V 100mA (Ta) 100mW (Ta) Surface Mount CST3; ComponentLink1Description: New link; ComponentLink1URL: https://www.digikey.com.au/en/products/detail/toshiba-semiconductor-and-storage/SSM3K15ACT-L3F/5298026
R128 = ERJ-1GNF1003C: 100 kOhms ±1% 0.05W, 1/20W Chip Resistor 0201 (0603 Metric) Thick Film; ComponentLink1Description: New link; ComponentLink1URL: https://www.digikey.com.au/en/products/detail/panasonic-electronic-components/ERJ-1GNF1003C/2036340
R129 = ERJ-1GNF1001C: 1 kOhms ±1% 0.05W, 1/20W Chip Resistor 0201 (0603 Metric) Thick Film
R130 = ERJ-1GNF1002C: as R66-R68 on sheet WIFI and BLE; ComponentLink1Description: New link; ComponentLink1URL: https://www.digikey.com.au/en/products/detail/panasonic-electronic-components/ERJ-1GNF1002C/2036226
R131 R132 = ERJ-1GN0R00C: as DNC on sheet WIFI and BLE; ComponentLink1Description: New link; ComponentLink1URL: https://www.digikey.com.au/en/products/detail/panasonic-electronic-components/ERJ-1GN0R00C/3982613
R169 R170 = RC0201FR-072K2L: 2.2 kOhms ±1% 0.05W, 1/20W Chip Resistor 0201 (0603 Metric) Moisture Resistant Thick Film
U300 U301 = ECMF4-40A100N10: as U?#7 on sheet Display; ComponentLink1Description: New link; ComponentLink1URL: https://www.digikey.com/en/products/detail/stmicroelectronics/ECMF4-40A100N10/16379603
U302 = ECMF4-40A100N6: 2 Line Common Mode Choke Surface Mount 100mA DCR 3Ohm (Typ)

## Sheet CPU_power.SchDoc
size 420 x 297 mm; SheetNumber: 4; SheetTotal: 17
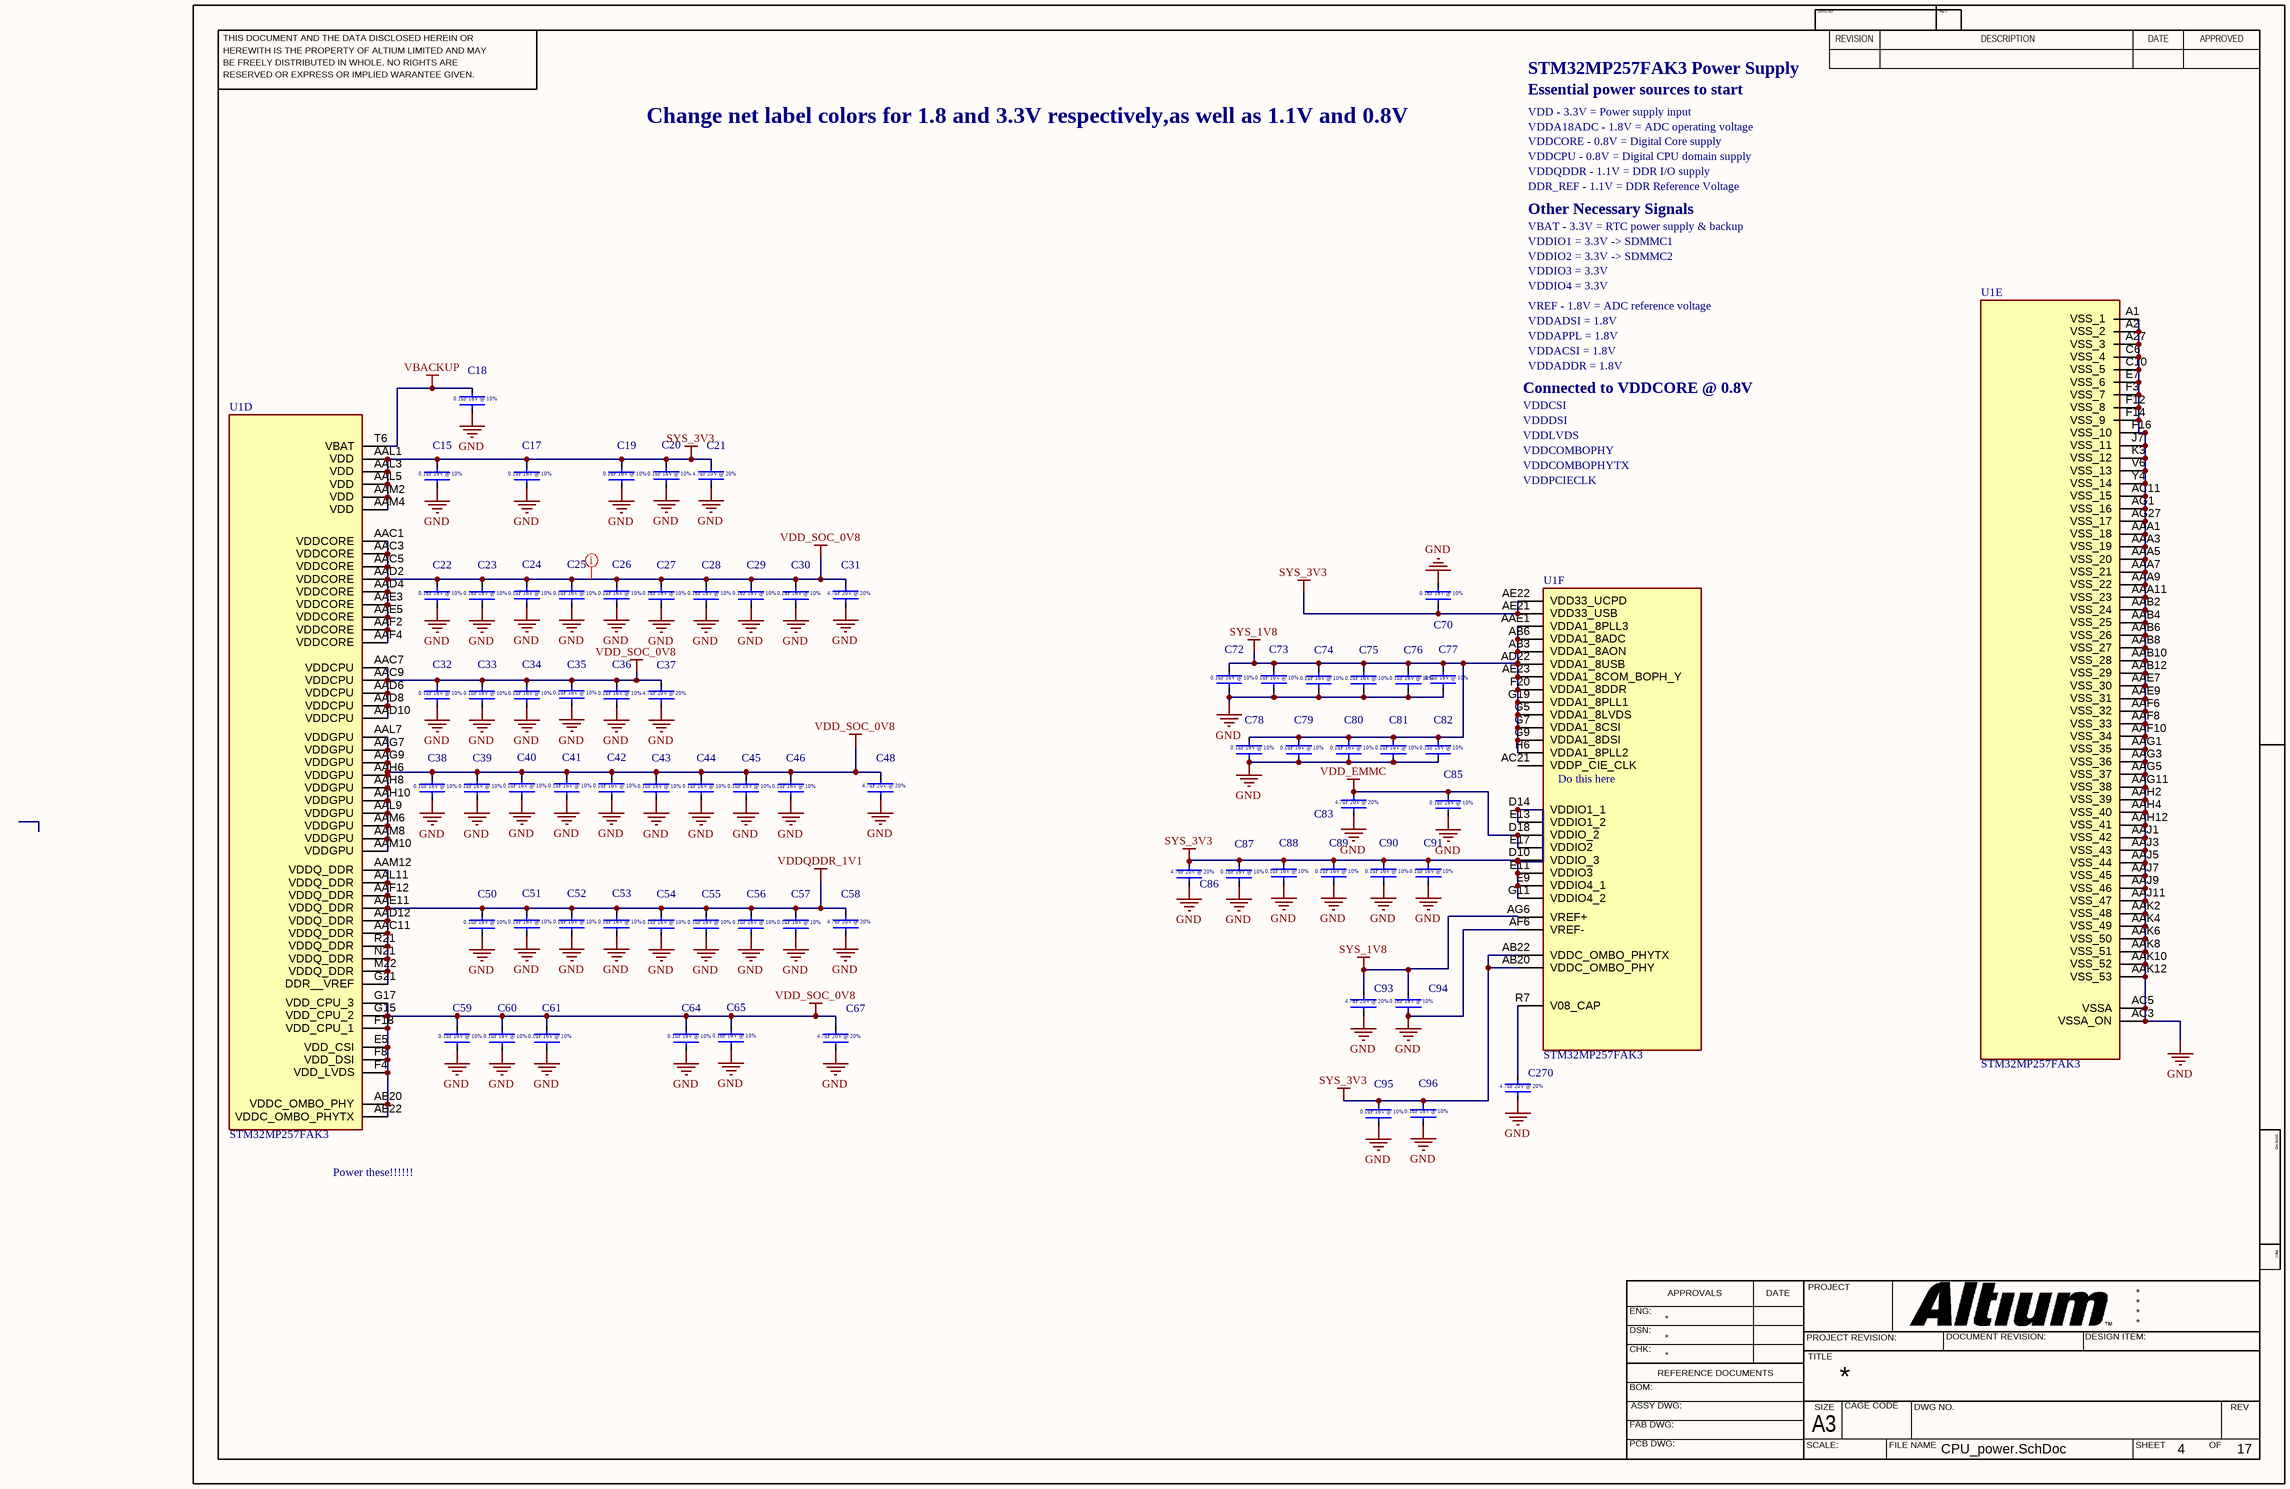
[diagram p18: CPU_power.SchDoc]

### Parts
C15  0.1uF  [CAPC0603X03L]  (value not drawn)
C17  0.1uF  [CAPC0603X03L]  (value not drawn)
C18  0.1uF  [CAPC0603X03L]  (value not drawn)
C19  0.1uF  [CAPC0603X03L]  (value not drawn)
C20  0.1uF  [CAPC0603X03L]  (value not drawn)
C21  4.7uF  [CAPC1005X06L]  (value not drawn)
C22  0.1uF  [CAPC0603X03L]  (value not drawn)
C23  0.1uF  [CAPC0603X03L]  (value not drawn)
C24  0.1uF  [CAPC0603X03L]  (value not drawn)
C25  0.1uF  [CAPC0603X03L]  (value not drawn)
C26  0.1uF  [CAPC0603X03L]  (value not drawn)
C27  0.1uF  [CAPC0603X03L]  (value not drawn)
C28  0.1uF  [CAPC0603X03L]  (value not drawn)
C29  0.1uF  [CAPC0603X03L]  (value not drawn)
C30  0.1uF  [CAPC0603X03L]  (value not drawn)
C31  4.7uF  [CAPC1005X06L]  (value not drawn)
C32  0.1uF  [CAPC0603X03L]  (value not drawn)
C33  0.1uF  [CAPC0603X03L]  (value not drawn)
C34  0.1uF  [CAPC0603X03L]  (value not drawn)
C35  0.1uF  [CAPC0603X03L]  (value not drawn)
C36  0.1uF  [CAPC0603X03L]  (value not drawn)
C37  4.7uF  [CAPC1005X06L]  (value not drawn)
C38  0.1uF  [CAPC0603X03L]  (value not drawn)
C39  0.1uF  [CAPC0603X03L]  (value not drawn)
C40  0.1uF  [CAPC0603X03L]  (value not drawn)
C41  0.1uF  [CAPC0603X03L]  (value not drawn)
C42  0.1uF  [CAPC0603X03L]  (value not drawn)
C43  0.1uF  [CAPC0603X03L]  (value not drawn)
C44  0.1uF  [CAPC0603X03L]  (value not drawn)
C45  0.1uF  [CAPC0603X03L]  (value not drawn)
C46  0.1uF  [CAPC0603X03L]  (value not drawn)
C48  4.7uF  [CAPC1005X06L]  (value not drawn)
C50  0.1uF  [CAPC0603X03L]  (value not drawn)
C51  0.1uF  [CAPC0603X03L]  (value not drawn)
C52  0.1uF  [CAPC0603X03L]  (value not drawn)
C53  0.1uF  [CAPC0603X03L]  (value not drawn)
C54  0.1uF  [CAPC0603X03L]  (value not drawn)
C55  0.1uF  [CAPC0603X03L]  (value not drawn)
C56  0.1uF  [CAPC0603X03L]  (value not drawn)
C57  0.1uF  [CAPC0603X03L]  (value not drawn)
C58  4.7uF  [CAPC1005X06L]  (value not drawn)
C59  0.1uF  [CAPC0603X03L]  (value not drawn)
C60  0.1uF  [CAPC0603X03L]  (value not drawn)
C61  0.1uF  [CAPC0603X03L]  (value not drawn)
C64  0.1uF  [CAPC0603X03L]  (value not drawn)
C65  0.1uF  [CAPC0603X03L]  (value not drawn)
C67  4.7uF  [CAPC1005X06L]  (value not drawn)
C70  0.1uF  [CAPC0603X03L]  (value not drawn)
C72  0.1uF  [CAPC0603X03L]  (value not drawn)
C73  0.1uF  [CAPC0603X03L]  (value not drawn)
C74  0.1uF  [CAPC0603X03L]  (value not drawn)
C75  0.1uF  [CAPC0603X03L]  (value not drawn)
C76  0.1uF  [CAPC0603X03L]  (value not drawn)
C77  0.1uF  [CAPC0603X03L]  (value not drawn)
C78  0.1uF  [CAPC0603X03L]  (value not drawn)
C79  0.1uF  [CAPC0603X03L]  (value not drawn)
C80  0.1uF  [CAPC0603X03L]  (value not drawn)
C81  0.1uF  [CAPC0603X03L]  (value not drawn)
C82  0.1uF  [CAPC0603X03L]  (value not drawn)
C83  4.7uF  [CAPC1005X06L]  (value not drawn)
C85  0.1uF  [CAPC0603X03L]  (value not drawn)
C86  4.7uF  [CAPC1005X06L]  (value not drawn)
C87  0.1uF  [CAPC0603X03L]  (value not drawn)
C88  0.1uF  [CAPC0603X03L]  (value not drawn)
C89  0.1uF  [CAPC0603X03L]  (value not drawn)
C90  0.1uF  [CAPC0603X03L]  (value not drawn)
C91  0.1uF  [CAPC0603X03L]  (value not drawn)
C93  4.7uF  [CAPC1005X06L]  (value not drawn)
C94  0.1uF  [CAPC0603X03L]  (value not drawn)
C95  0.1uF  [CAPC0603X03L]  (value not drawn)
C96  0.1uF  [CAPC0603X03L]  (value not drawn)
C270  4.7uF  [CAPC1005X06L]  (value not drawn)
U1  STM32MP257FAK3  [STM32MP257FAK3]  (parts D,E,F of 7)

### Nets
GND: C15.1 C17.1 C18.1 C19.1 C20.1 C21.1 C22.1 C23.1 C24.1 C25.1 C26.1 C27.1 C28.1 C29.1 C30.1 C31.1 C32.1 C33.1 C34.1 C35.1 C36.1 C37.1 C38.1 C39.1 C40.1 C41.1 C42.1 C43.1 C44.1 C45.1 C46.1 C48.1 C50.1 C51.1 C52.1 C53.1 C54.1 C55.1 C56.1 C57.1 C58.1 C59.1 C60.1 C61.1 C64.1 C65.1 C67.1 C70.2 C72.1 C73.1 C74.1 C75.1 C76.1 C77.1 C78.1 C79.1 C80.1 C81.1 C82.1 C83.1 C85.1 C86.1 C87.1 C88.1 C89.1 C90.1 C91.1 C93.1 C94.1 C95.1 C96.1 C270.1 U1.A1(VSS_1) U1.A2(VSS_2) U1.A27(VSS_3) U1.AAA1(VSS_18) U1.AAA3(VSS_19) U1.AAA5(VSS_20) U1.AAA7(VSS_21) U1.AAA9(VSS_22) U1.AAA11(VSS_23) U1.AAB2(VSS_24) U1.AAB4(VSS_25) U1.AAB6(VSS_26) U1.AAB8(VSS_27) U1.AAB10(VSS_28) U1.AAB12(VSS_29) U1.AAE7(VSS_30) U1.AAE9(VSS_31) U1.AAF6(VSS_32) U1.AAF8(VSS_33) U1.AAF10(VSS_34) U1.AAG1(VSS_35) U1.AAG3(VSS_36) U1.AAG5(VSS_37) U1.AAG11(VSS_38) U1.AAH2(VSS_39) U1.AAH4(VSS_40) U1.AAH12(VSS_41) U1.AAJ1(VSS_42) U1.AAJ3(VSS_43) U1.AAJ5(VSS_44) U1.AAJ7(VSS_45) U1.AAJ9(VSS_46) U1.AAJ11(VSS_47) U1.AAK2(VSS_48) U1.AAK4(VSS_49) U1.AAK6(VSS_50) U1.AAK8(VSS_51) U1.AAK10(VSS_52) U1.AAK12(VSS_53) U1.AC3(VSSA_ON) U1.AC5(VSSA) U1.AC11(VSS_15) U1.AF6(VREF-) U1.AG1(VSS_16) U1.AG27(VSS_17) U1.C6(VSS_4) U1.C10(VSS_5) U1.E7(VSS_6) U1.F3(VSS_7) U1.F12(VSS_8) U1.F14(VSS_9) U1.F16(VSS_10) U1.J7(VSS_11) U1.K3(VSS_12) U1.V6(VSS_13) U1.Y4(VSS_14)
SYS_1V8: C72.2 C73.2 C74.2 C75.2 C76.2 C77.2 C78.2 C79.2 C80.2 C81.2 C82.2 C93.2 C94.2 U1.AAE1(VDDA1_8PLL3) U1.AB3(VDDA1_8AON) U1.AB6(VDDA1_8ADC) U1.AD22(VDDA1_8USB) U1.AE23(VDDA1_8COM_BOPH_Y) U1.AG6(VREF+) U1.F20(VDDA1_8DDR) U1.G5(VDDA1_8LVDS) U1.G7(VDDA1_8CSI) U1.G9(VDDA1_8DSI) U1.G19(VDDA1_8PLL1) U1.H6(VDDA1_8PLL2)
SYS_3V3: C15.2 C17.2 C19.2 C20.2 C21.2 C70.1 C86.2 C87.2 C88.2 C89.2 C90.2 C91.2 C95.2 C96.2 U1.AAL1(VDD) U1.AAL3(VDD) U1.AAL5(VDD) U1.AAM2(VDD) U1.AAM4(VDD) U1.AB20(VDDC_OMBO_PHY) U1.AB22(VDDC_OMBO_PHYTX) U1.AE21(VDD33_USB) U1.AE22(VDD33_UCPD) U1.D10(VDDIO_3) U1.D14(VDDIO1_1) U1.E9(VDDIO4_1) U1.E11(VDDIO3) U1.E13(VDDIO1_2) U1.G11(VDDIO4_2)
VBACKUP: C18.2 U1.T6(VBAT)
VDD_EMMC: C83.2 C85.2 U1.D18(VDDIO_2) U1.E17(VDDIO2)
VDD_SOC_0V8: C22.2 C23.2 C24.2 C25.2 C26.2 C27.2 C28.2 C29.2 C30.2 C31.2 C32.2 C33.2 C34.2 C35.2 C36.2 C37.2 C38.2 C39.2 C40.2 C41.2 C42.2 C43.2 C44.2 C45.2 C46.2 C48.2 C59.2 C60.2 C61.2 C64.2 C65.2 C67.2 U1.AAC1(VDDCORE) U1.AAC3(VDDCORE) U1.AAC5(VDDCORE) U1.AAC7(VDDCPU) U1.AAC9(VDDCPU) U1.AAD2(VDDCORE) U1.AAD4(VDDCORE) U1.AAD6(VDDCPU) U1.AAD8(VDDCPU) U1.AAD10(VDDCPU) U1.AAE3(VDDCORE) U1.AAE5(VDDCORE) U1.AAF2(VDDCORE) U1.AAF4(VDDCORE) U1.AAG7(VDDGPU) U1.AAG9(VDDGPU) U1.AAH6(VDDGPU) U1.AAH8(VDDGPU) U1.AAH10(VDDGPU) U1.AAL7(VDDGPU) U1.AAL9(VDDGPU) U1.AAM6(VDDGPU) U1.AAM8(VDDGPU) U1.AAM10(VDDGPU) U1.AB20(VDDC_OMBO_PHY) U1.AB22(VDDC_OMBO_PHYTX) U1.E5(VDD_CSI) U1.F4(VDD_LVDS) U1.F8(VDD_DSI) U1.F18(VDD_CPU_1) U1.G15(VDD_CPU_2) U1.G17(VDD_CPU_3)
VDDQDDR_1V1: C50.2 C51.2 C52.2 C53.2 C54.2 C55.2 C56.2 C57.2 C58.2 U1.AAC11(VDDQ_DDR) U1.AAD12(VDDQ_DDR) U1.AAE11(VDDQ_DDR) U1.AAF12(VDDQ_DDR) U1.AAL11(VDDQ_DDR) U1.AAM12(VDDQ_DDR) U1.G21(DDR__VREF) U1.M22(VDDQ_DDR) U1.N21(VDDQ_DDR) U1.R21(VDDQ_DDR)
NetC270_2: C270.2 U1.R7(V08_CAP)

Not connected (* = marked no-connect by the designer): U1 AC21(VDDP_CIE_CLK)

### Layout directives
net class MPU_PWR: VDD_SOC_0V8

### Notes on the sheet
- STM32MP257FAK3 Power Supply
- VDD - 3.3V = Power supply input
- Essential power sources to start
- Change net label colors for 1.8 and 3.3V respectively,as well as 1.1V and 0.8V
- VDDQDDR - 1.1V = DDR I/O supply
- VDDA18ADC - 1.8V = ADC operating voltage
- VDDCORE - 0.8V = Digital Core supply
- VDDCPU - 0.8V = Digital CPU domain supply
- VBAT - 3.3V = RTC power supply & backup
- Other Necessary Signals
- VDDIO1 = 3.3V -> SDMMC1
- DDR_REF - 1.1V = DDR Reference Voltage
- VREF - 1.8V = ADC reference voltage
- VDDIO2 = 3.3V -> SDMMC2
- VDDIO3 = 3.3V
- VDDIO4 = 3.3V
- VDDADSI = 1.8V
- VDDAPPL = 1.8V
- VDDACSI = 1.8V
- VDDADDR = 1.8V
- Connected to VDDCORE @ 0.8V
- VDDCSI
- VDDDSI
- VDDLVDS
- VDDCOMBOPHY
- VDDPCIECLK
- VDDCOMBOPHYTX
- (near U1) Do this here
- Power these!!!!!!
- THIS DOCUMENT AND THE DATA DISCLOSED HEREIN OR
- HEREWITH IS THE PROPERTY OF ALTIUM LIMITED AND MAY
- DWG NO:
- REVISION
- REV:
- DESCRIPTION
- DATE
- APPROVED
- BE FREELY DISTRIBUTED IN WHOLE. NO RIGHTS ARE
- RESERVED OR EXPRESS OR IMPLIED WARANTEE GIVEN.
- ENG:
- APPROVALS
- PROJECT
- DSN:
- CHK:
- REFERENCE DOCUMENTS
- PROJECT REVISION:
- TITLE
- DOCUMENT REVISION:
- DESIGN ITEM:
- BOM:
- FAB DWG:
- PCB DWG:
- ASSY DWG:
- SCALE:
- A3
- SIZE
- CAGE CODE
- FILE NAME
- DWG NO.
- SHEET
- OF
- REV
- (in symbol CL05A475MO5NUNC) 4.7uF 20V @ 20%
- (in symbol GRM033R61E104KE14J) 0.1uF 16V @ 10%

### Library data of the parts
C15 C17-C20 C22-C30 C32-C36 C38-C46 C50-C57 C59-C61 C64 C65 C70 C72-C82 C85 C87-C91 C94-C96 = GRM033R61E104KE14J: 0.1 µF ±10% 25V Ceramic Capacitor X5R 0201 (0603 Metric)0.1 µF ±10% 25V Ceramic Capacitor X5R 0201 (0603 Metric); Parameter 1: MPU CAPS
C21 C31 C37 C48 C58 C67 C83 C86 C93 C270 = CL05A475MO5NUNC: 4.7 µF ±20% 16V Ceramic Capacitor X5R 0402 (1005 Metric); Parameter 1: MPU CAPS
U1 = STM32MP257FAK3: Integrated Circuit; Manufacturer_Name: STMicroelectronics; Datasheet Link: https://www.digikey.ph/en/products/detail/stmicroelectronics/STM32MP257FAK3/24883094; Height: 1mm; Manufacturer_Part_Number: STM32MP257FAK3; Mouser Part Number: 511-STM32MP257FAK3; Mouser Price/Stock: https://www.mouser.co.uk/ProductDetail/STMicroelectronics/STM32MP257FAK3?qs=i8QVZAFTkqQulHX8Hxkfng%3D%3D; Arrow Part Number: STM32MP257FAK3; Arrow Price/Stock: https://www.arrow.com/en/products/stm32mp257fak3/stmicroelectronics?utm_currency=USD&region=nac